# EAGLE design Backer Boards 01April15 (EAGLE 6.5.0)

## Sheet 1 of 7
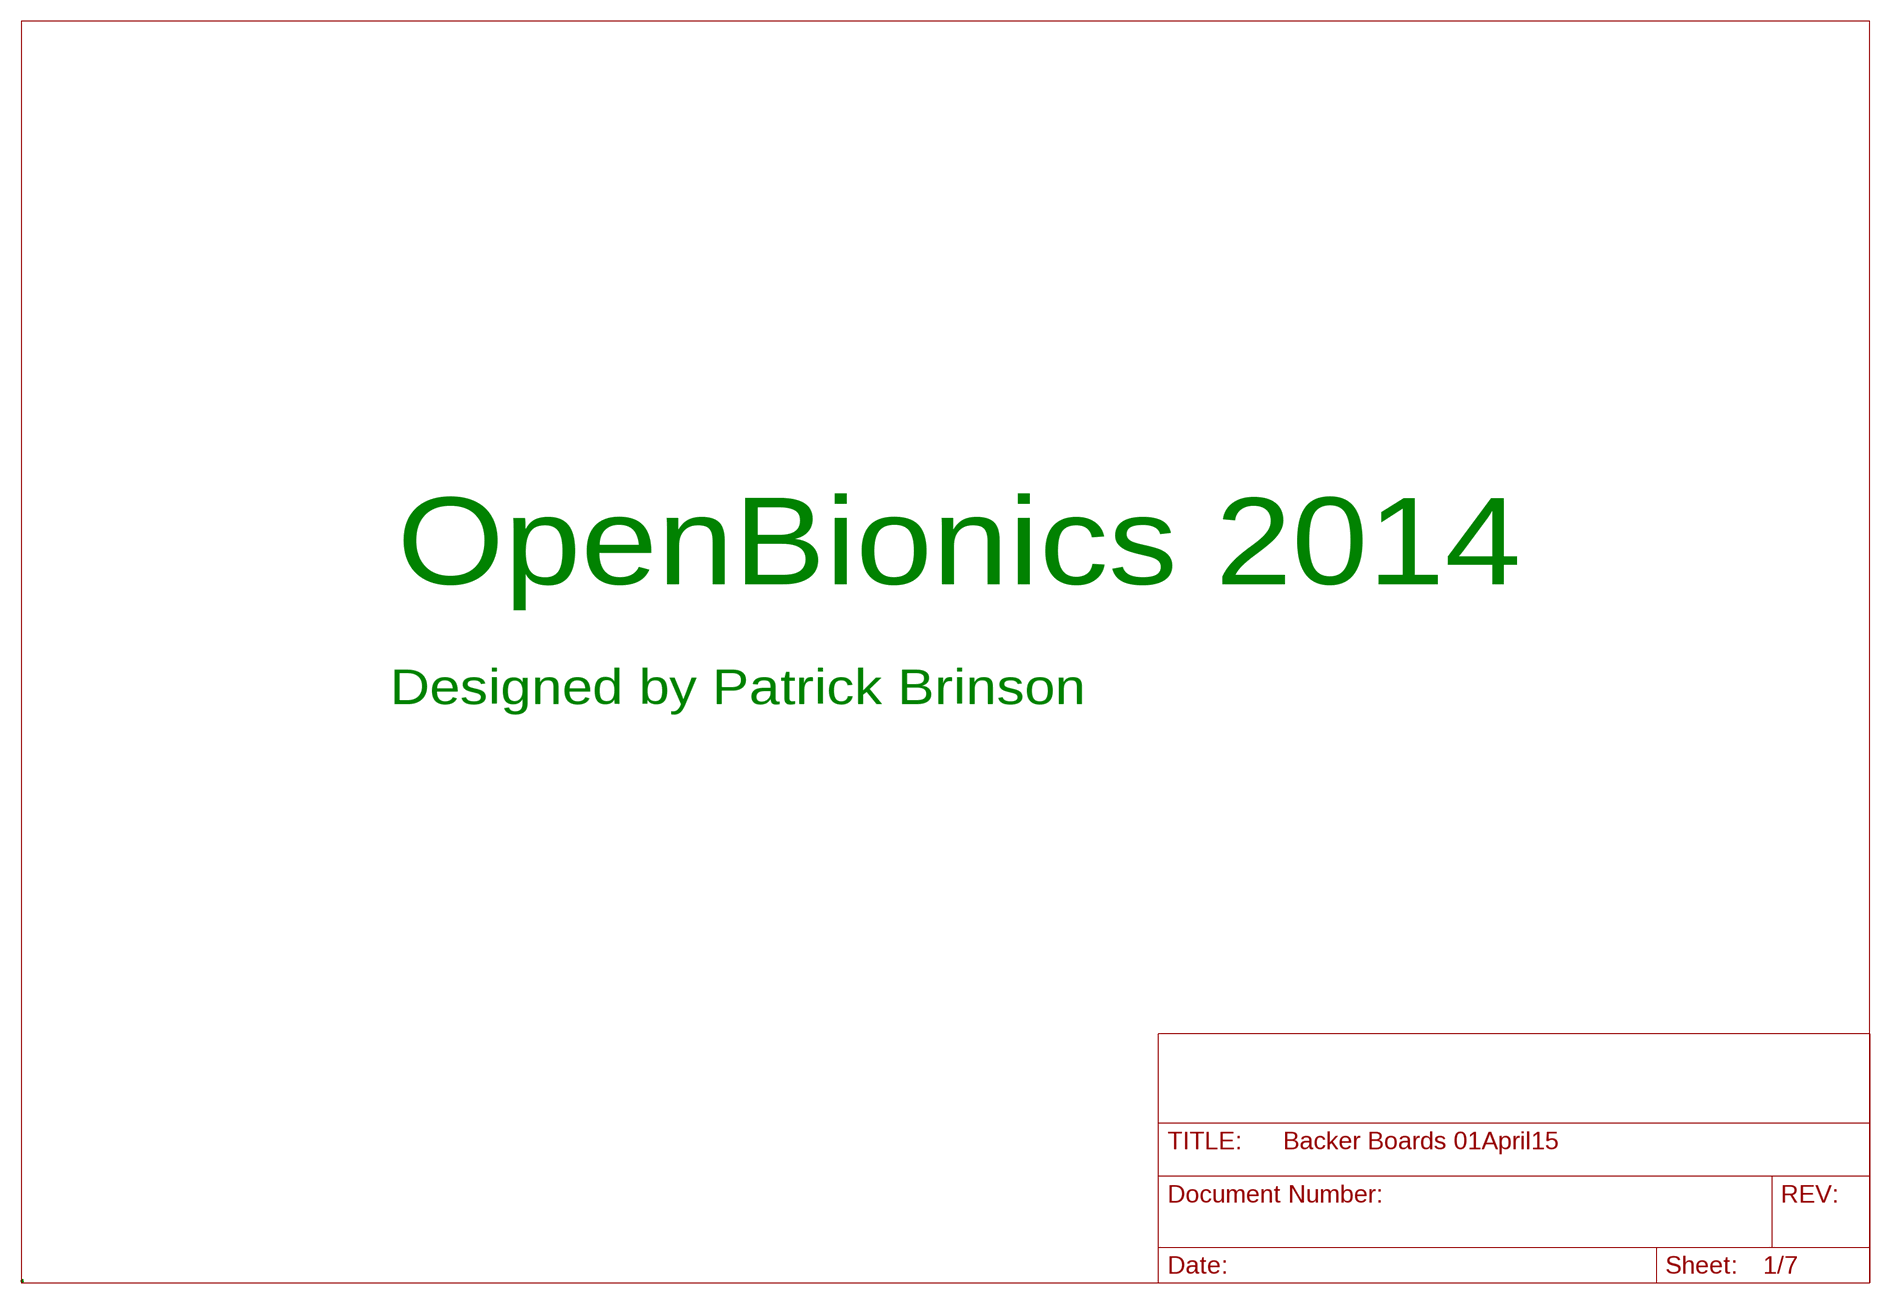
[diagram p0: schematic, sheet 1]

### Notes on the sheet
- OpenBionics 2014
- Designed by Patrick Brinson

## Sheet 2 of 7: POWER
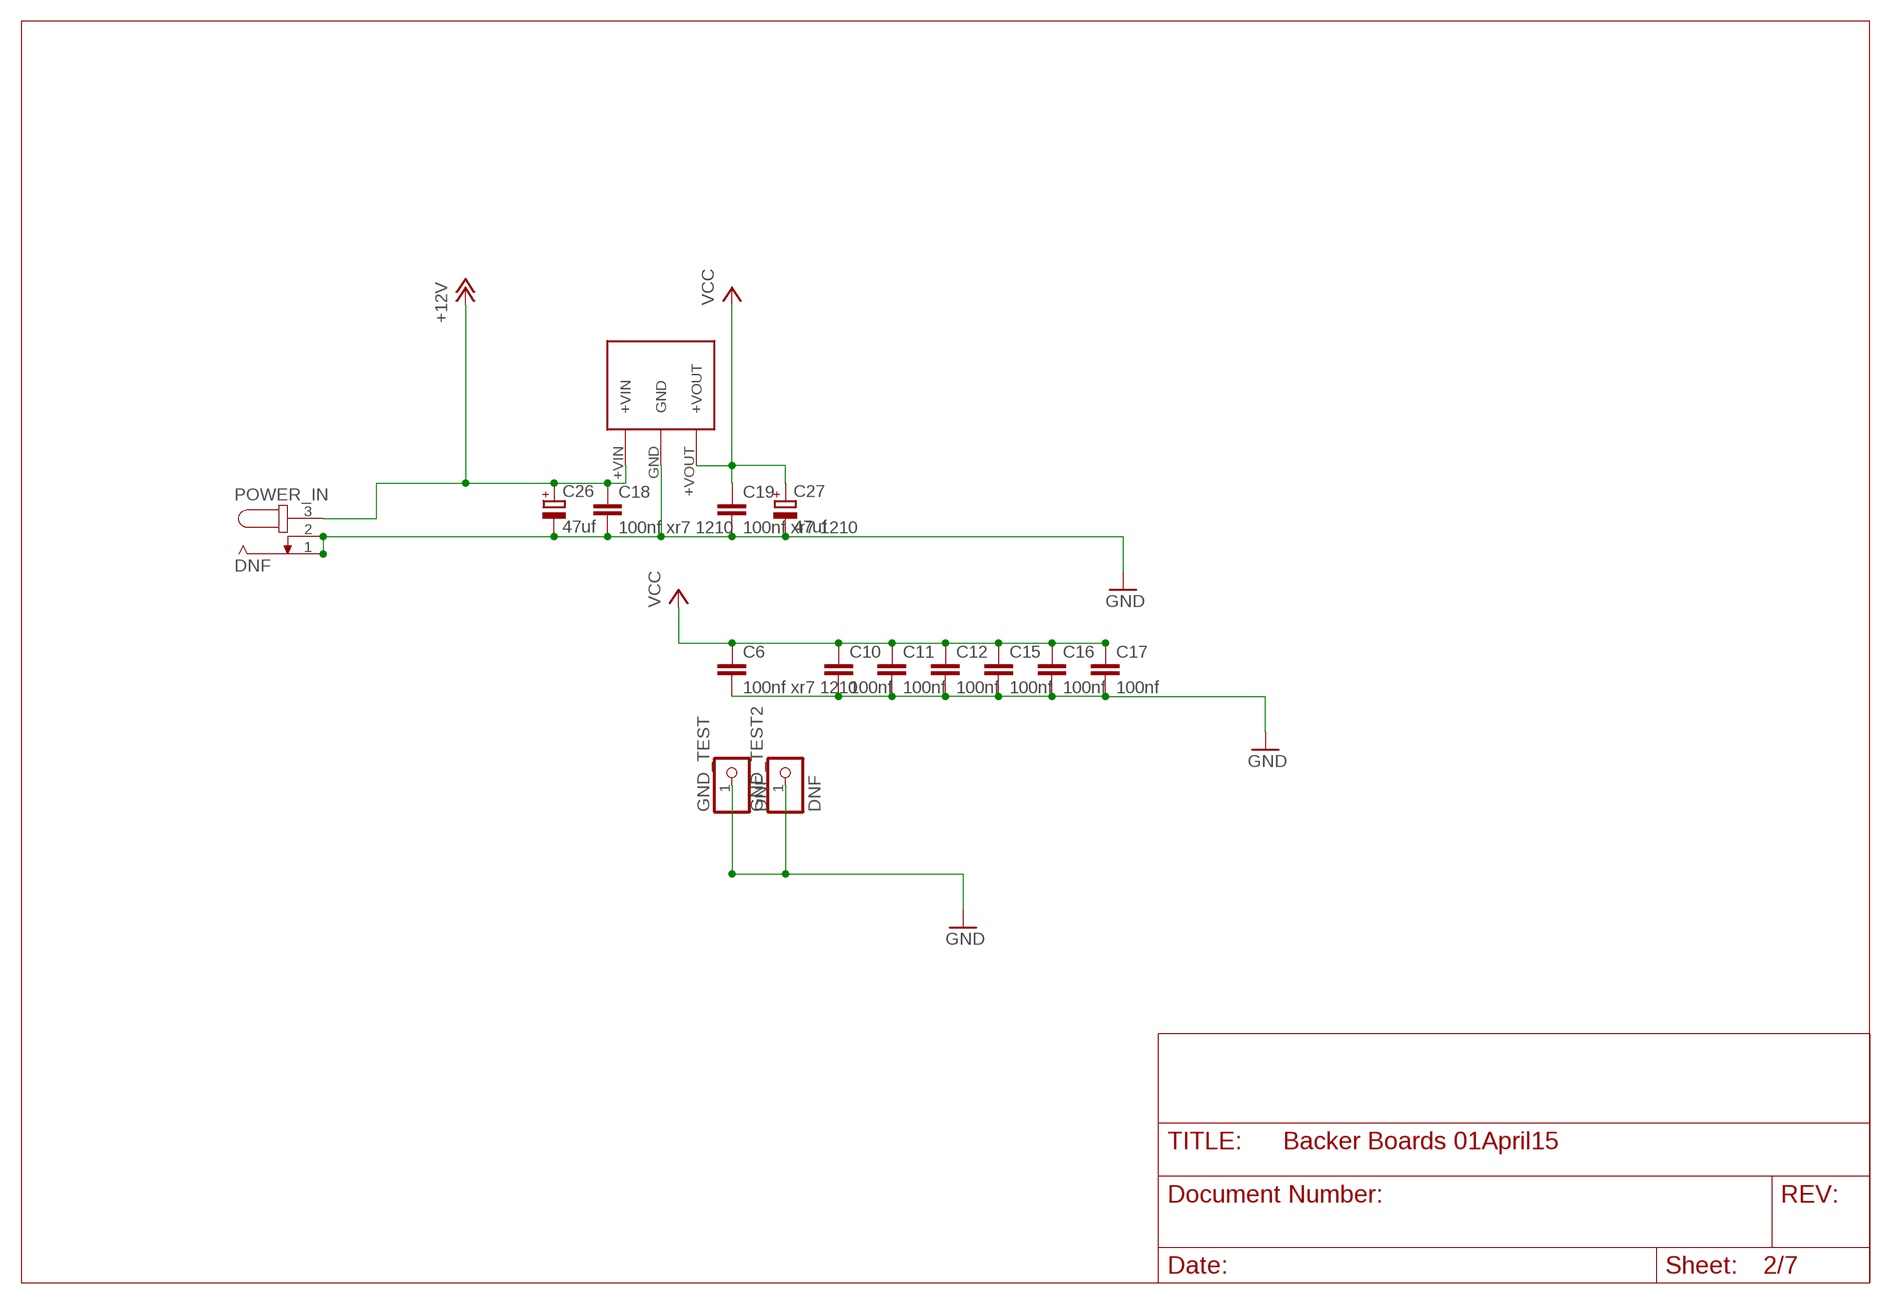
[diagram p1: schematic, sheet 2]

### Parts
5V_REG  DNF  5V_RECOM_0.5A_REGULATOR  [5V_RECOM_0.5A_REGULATOR]
C6  100nf xr7 1210  C-EUC1210  [C1210]
C10  100nf  C-EUC0603  [C0603]
C11  100nf  C-EUC0603  [C0603]
C12  100nf  C-EUC0603  [C0603]
C15  100nf  C-EUC0603  [C0603]
C16  100nf  C-EUC0603  [C0603]
C17  100nf  C-EUC0603  [C0603]
C18  100nf xr7 1210  C-EUC1210  [C1210]
C19  100nf xr7 1210  C-EUC1210  [C1210]
C26  47uf  CPOL-EUC  [PANASONIC_C]
C27  47uf  CPOL-EUC  [PANASONIC_C]
GND_TEST  DNF  HEADER-1X1ROUND  [1X01_ROUND]
GND_TEST2  DNF  HEADER-1X1ROUND  [1X01_ROUND]
POWER_IN  DNF  JACK-PLUG1  [SPC4078]

### Nets
+12V: 5V_REG.+VIN C18.1 C26.+ POWER_IN.3 ; also sheet 4,5,6
GND: 5V_REG.GND C6.2 C10.2 C11.2 C12.2 C15.2 C16.2 C17.2 C18.2 C19.2 C26.- C27.- GND_TEST2.1 GND_TEST.1 POWER_IN.1 POWER_IN.2 ; also sheet 3,4,5,6,7
VCC: 5V_REG.+VOUT C6.1 C10.1 C11.1 C12.1 C15.1 C16.1 C17.1 C19.1 C27.+ ; also sheet 3,4,5,6,7

## Sheet 3 of 7: ATMEGA 2560
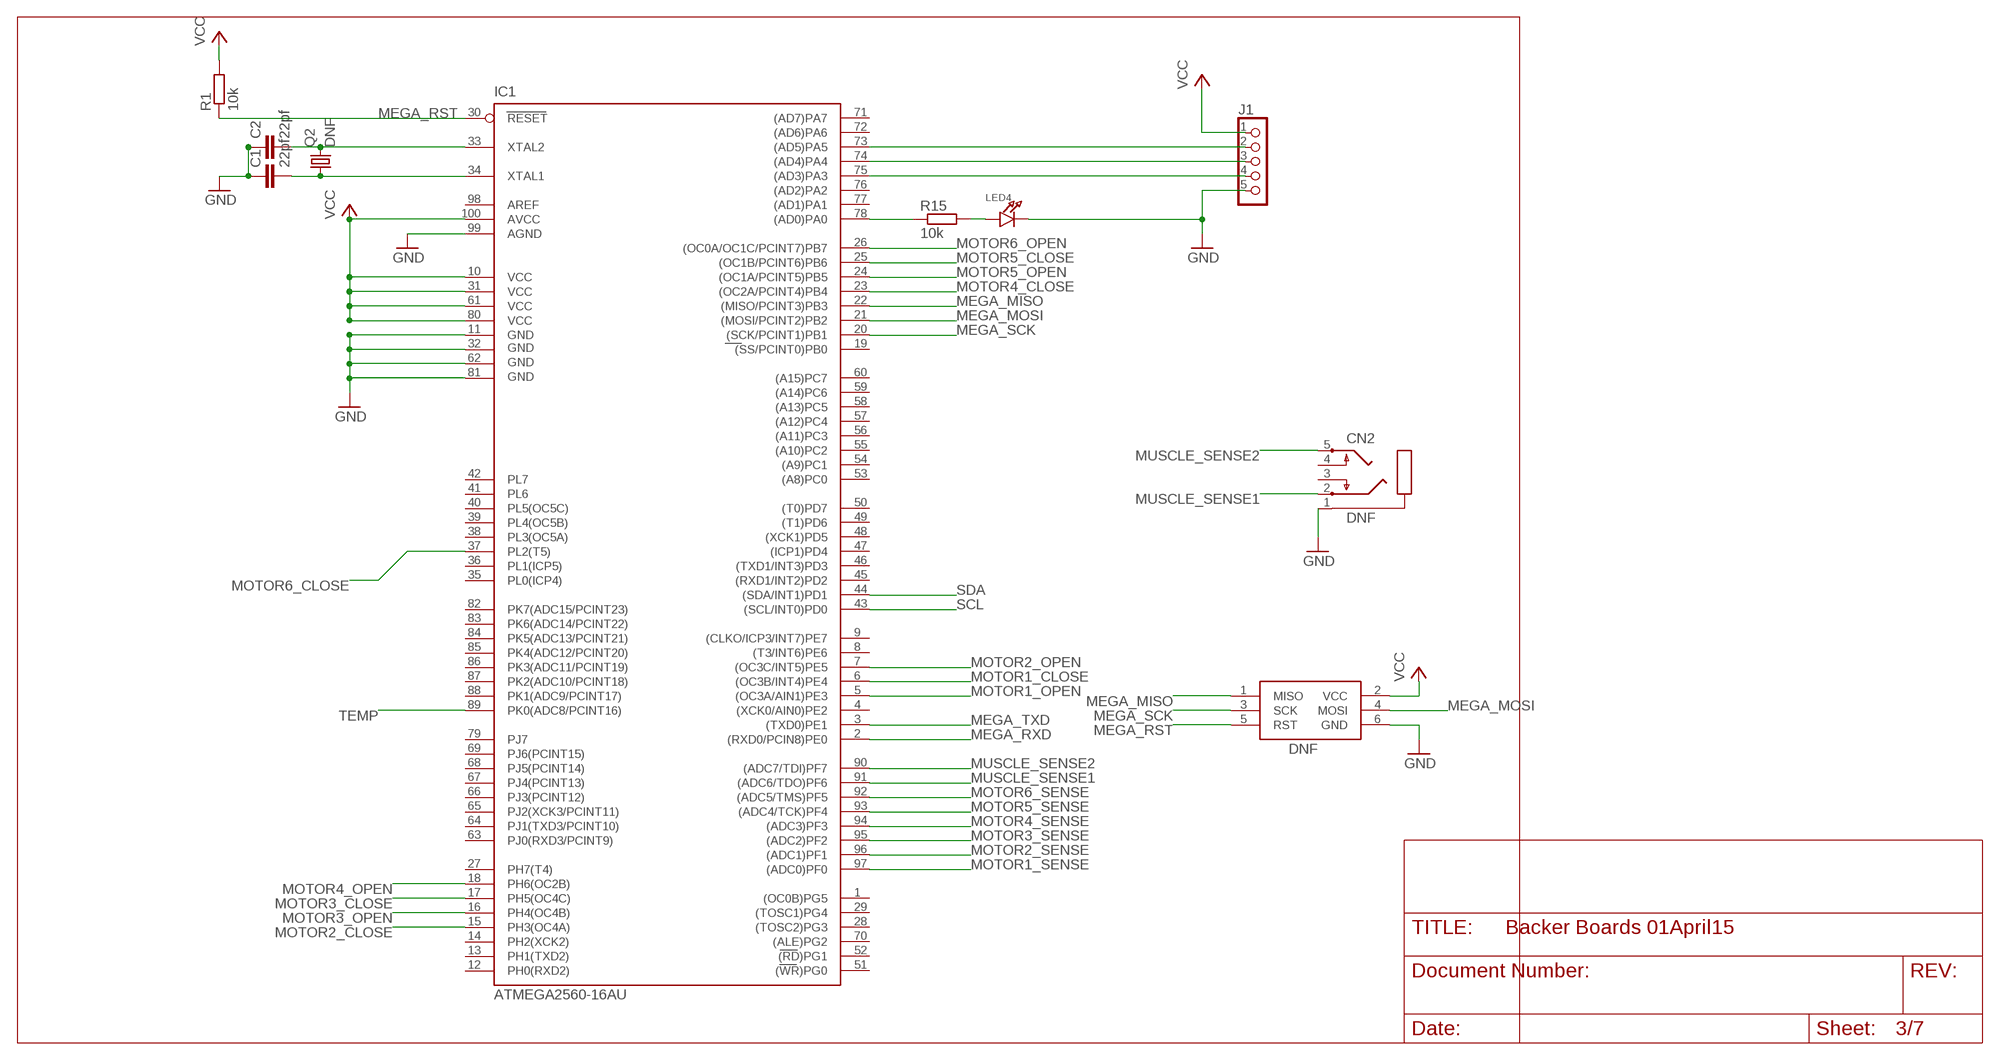
[diagram p2: schematic, sheet 3]

### Parts
C1  22pf  C-EUC0603  [C0603]
C2  22pf  C-EUC0603  [C0603]
CN2  DNF  AUDIO_STEREOJACK  [STX3100]
DNF  AVRISP-6  [AVRISP]
IC1  ATMEGA2560-16AU  [TQFP100]
J1  DNF  CON_HEADER_1X05-PTH  [M1X5]
LED4  LED0805  [CHIPLED_0805]
Q2  DNF  CRYSTALHC49S  [HC49/S]
R1  10k  R-EU_R0603  [R0603]
R15  10k  R-EU_R0603  [R0603]

### Nets
GND: C1.1 C2.1 CN2.1 DNF.6(GND) IC1.11(GND) IC1.32(GND1) IC1.62(GND2) IC1.81(GND3) IC1.99(AGND) J1.5 LED4.C ; also sheet 2,4,5,6,7
MEGA_MISO: DNF.1(MISO) IC1.22((MISO/PCINT3)PB3)
MEGA_MOSI: DNF.4(MOSI) IC1.21((MOSI/PCINT2)PB2)
MEGA_RST: DNF.5(RST) IC1.30(RESET) R1.1 ; also sheet 7
MEGA_RXD: IC1.2((RXD0/PCIN8)PE0) ; also sheet 7
MEGA_SCK: DNF.3(SCK) IC1.20((SCK/PCINT1)PB1)
MEGA_TXD: IC1.3((TXD0)PE1) ; also sheet 7
MOTOR1_CLOSE: IC1.6((OC3B/INT4)PE4) ; also sheet 4
MOTOR1_OPEN: IC1.5((OC3A/AIN1)PE3) ; also sheet 4
MOTOR1_SENSE: IC1.97((ADC0)PF0) ; also sheet 4
MOTOR2_CLOSE: IC1.15(PH3(OC4A)) ; also sheet 4
MOTOR2_OPEN: IC1.7((OC3C/INT5)PE5) ; also sheet 4
MOTOR2_SENSE: IC1.96((ADC1)PF1) ; also sheet 4
MOTOR3_CLOSE: IC1.17(PH5(OC4C)) ; also sheet 5
MOTOR3_OPEN: IC1.16(PH4(OC4B)) ; also sheet 5
MOTOR3_SENSE: IC1.95((ADC2)PF2) ; also sheet 5
MOTOR4_CLOSE: IC1.23((OC2A/PCINT4)PB4) ; also sheet 5
MOTOR4_OPEN: IC1.18(PH6(OC2B)) ; also sheet 5
MOTOR4_SENSE: IC1.94((ADC3)PF3) ; also sheet 5
MOTOR5_CLOSE: IC1.25((OC1B/PCINT6)PB6) ; also sheet 6
MOTOR5_OPEN: IC1.24((OC1A/PCINT5)PB5) ; also sheet 6
MOTOR5_SENSE: IC1.93((ADC4/TCK)PF4) ; also sheet 6
MOTOR6_CLOSE: IC1.37(PL2(T5))
MOTOR6_OPEN: IC1.26((OC0A/OC1C/PCINT7)PB7)
MOTOR6_SENSE: IC1.92((ADC5/TMS)PF5)
MUSCLE_SENSE1: CN2.2 IC1.91((ADC6/TDO)PF6)
MUSCLE_SENSE2: CN2.5 IC1.90((ADC7/TDI)PF7)
N$2: IC1.78((AD0)PA0) R15.1
N$11: LED4.A R15.2
N$29: IC1.75((AD3)PA3) J1.4
N$48: IC1.74((AD4)PA4) J1.3
N$50: IC1.73((AD5)PA5) J1.2
SCL: IC1.43((SCL/INT0)PD0)
SDA: IC1.44((SDA/INT1)PD1)
TEMP: IC1.89(PK0(ADC8/PCINT16))
VCC: DNF.2(VCC) IC1.10(VCC) IC1.31(VCC1) IC1.61(VCC2) IC1.80(VCC3) IC1.100(AVCC) J1.1 R1.2 ; also sheet 2,4,5,6,7
XTAL1: C1.2 IC1.34(XTAL1) Q2.1
XTAL2: C2.2 IC1.33(XTAL2) Q2.2
Unconnected: CN2.3 CN2.4 IC1.1((OC0B)PG5) IC1.4((XCK0/AIN0)PE2) IC1.8((T3/INT6)PE6) IC1.9((CLKO/ICP3/INT7)PE7) IC1.12(PH0(RXD2)) IC1.13(PH1(TXD2)) IC1.14(PH2(XCK2)) IC1.19((SS/PCINT0)PB0) IC1.27(PH7(T4)) IC1.28((TOSC2)PG3) IC1.29((TOSC1)PG4) IC1.35(PL0(ICP4)) IC1.36(PL1(ICP5)) IC1.38(PL3(OC5A)) IC1.39(PL4(OC5B)) IC1.40(PL5(OC5C)) IC1.41(PL6) IC1.42(PL7) IC1.45((RXD1/INT2)PD2) IC1.46((TXD1/INT3)PD3) IC1.47((ICP1)PD4) IC1.48((XCK1)PD5) IC1.49((T1)PD6) IC1.50((T0)PD7) IC1.51((WR)PG0) IC1.52((RD)PG1) IC1.53((A8)PC0) IC1.54((A9)PC1) IC1.55((A10)PC2) IC1.56((A11)PC3) IC1.57((A12)PC4) IC1.58((A13)PC5) IC1.59((A14)PC6) IC1.60((A15)PC7) IC1.63(PJ0(RXD3/PCINT9)) IC1.64(PJ1(TXD3/PCINT10)) IC1.65(PJ2(XCK3/PCINT11)) IC1.66(PJ3(PCINT12)) IC1.67(PJ4(PCINT13)) IC1.68(PJ5(PCINT14)) IC1.69(PJ6(PCINT15)) IC1.70((ALE)PG2) IC1.71((AD7)PA7) IC1.72((AD6)PA6) IC1.76((AD2)PA2) IC1.77((AD1)PA1) IC1.79(PJ7) IC1.82(PK7(ADC15/PCINT23)) IC1.83(PK6(ADC14/PCINT22)) IC1.84(PK5(ADC13/PCINT21)) IC1.85(PK4(ADC12/PCINT20)) IC1.86(PK3(ADC11/PCINT19)) IC1.87(PK2(ADC10/PCINT18)) IC1.88(PK1(ADC9/PCINT17)) IC1.98(AREF)

## Sheet 4 of 7: MOTOR 1&2
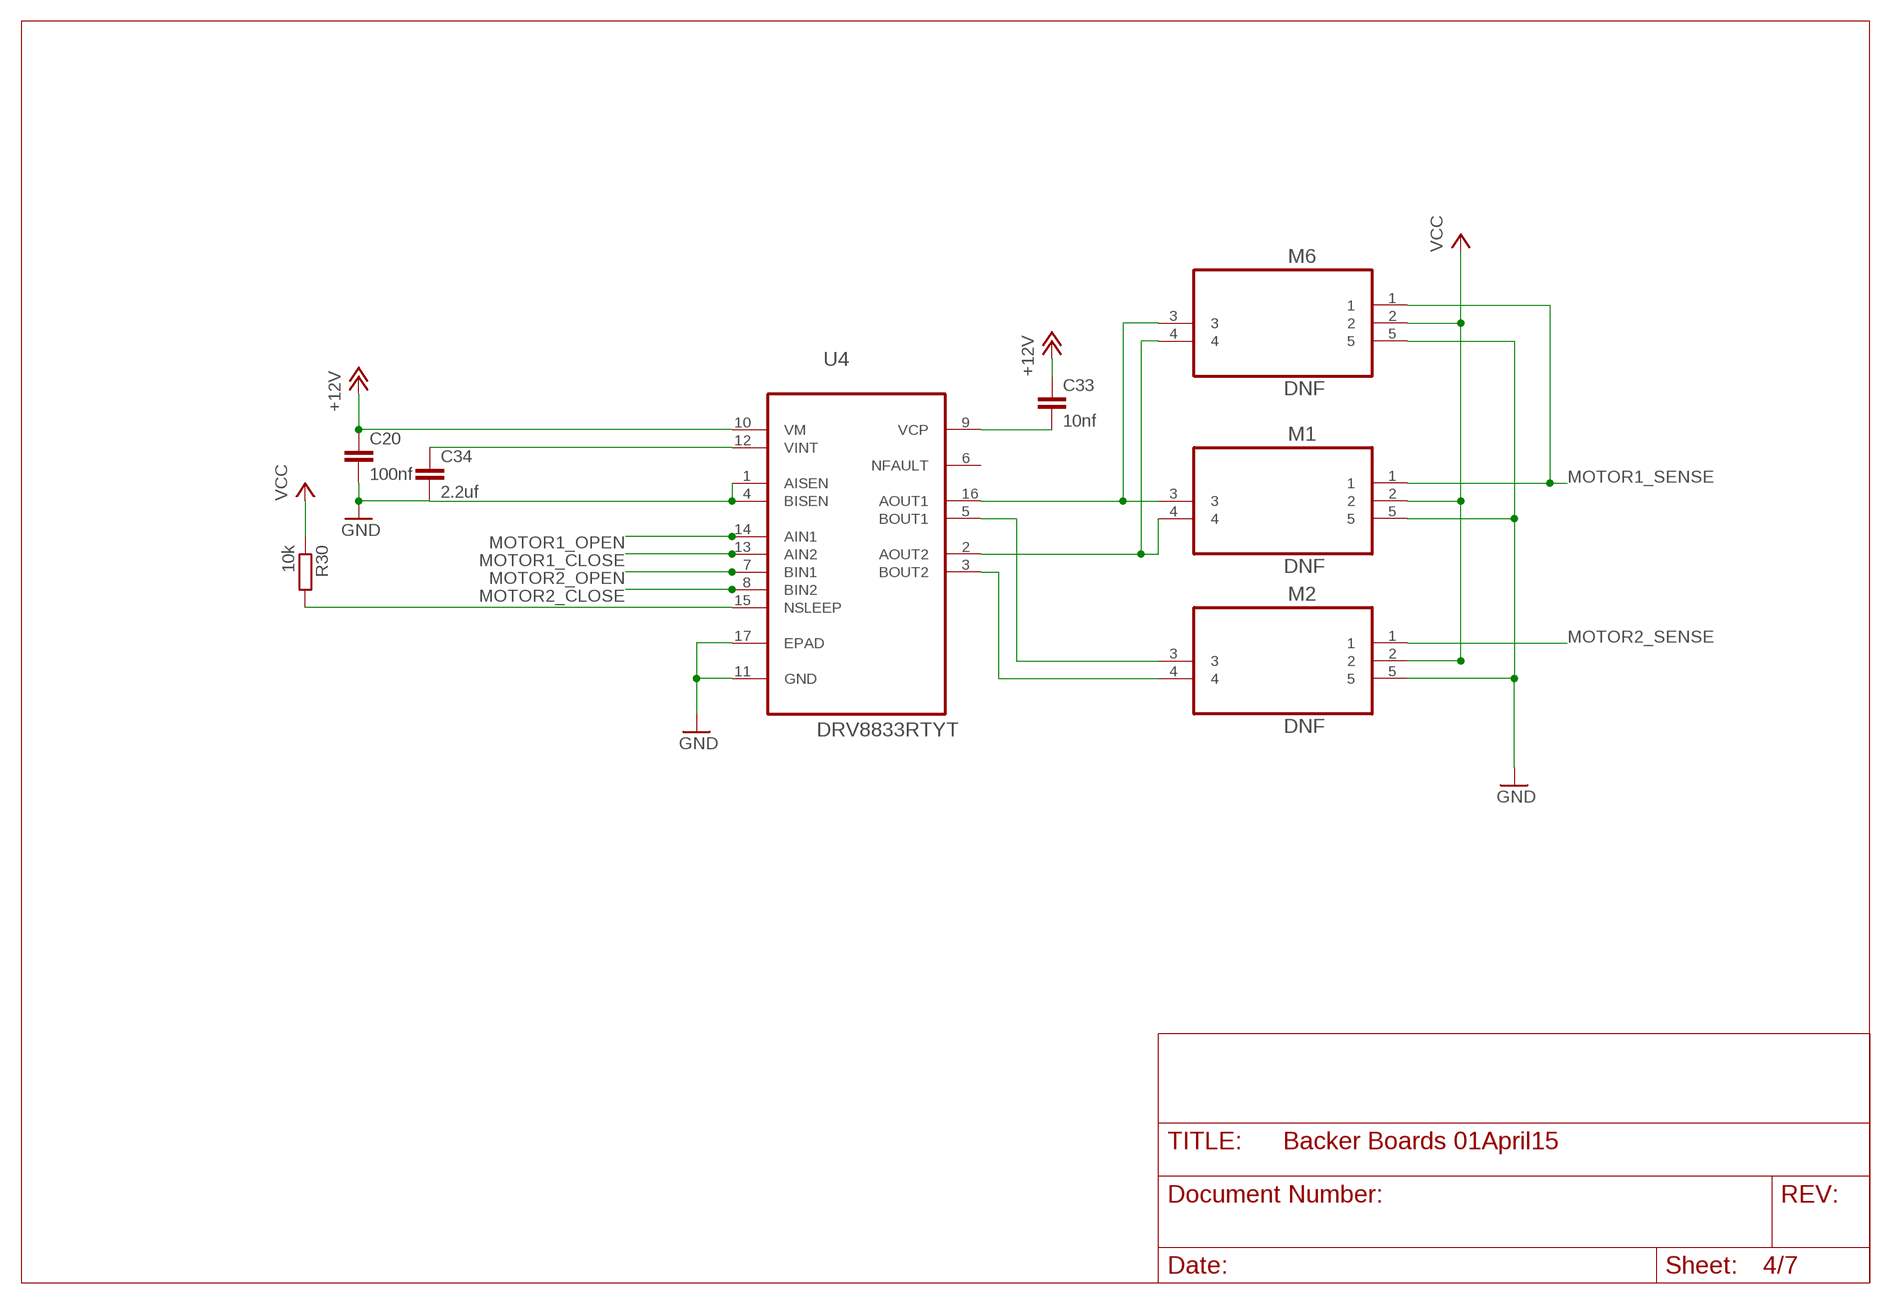
[diagram p3: schematic, sheet 4]

### Parts
C20  100nf  C-EUC0603  [C0603]
C33  10nf  C-EUC0603  [C0603]
C34  2.2uf  C-EUC0603  [C0603]
M1  DNF  SFW5R-1STE1LF  [FCI_SFW5R-1STE1LF]
M2  DNF  SFW5R-1STE1LF  [FCI_SFW5R-1STE1LF]
M6  DNF  SFW5R-1STE1LF  [FCI_SFW5R-1STE1LF]
R30  10k  R-EU_R0603  [R0603]
U4  DRV8833RTYT  [QFN65P400X400X80-17N]

### Nets
+12V: C20.1 C33.1 U4.10(VM) ; also sheet 2,5,6
GND: C20.2 C34.2 M1.5 M2.5 M6.5 U4.1(AISEN) U4.4(BISEN) U4.11(GND) U4.17(EPAD) ; also sheet 2,3,5,6,7
MOTOR1_CLOSE: U4.13(AIN2) ; also sheet 3
MOTOR1_OPEN: U4.14(AIN1) ; also sheet 3
MOTOR1_SENSE: M1.1 M6.1 ; also sheet 3
MOTOR2_CLOSE: U4.8(BIN2) ; also sheet 3
MOTOR2_OPEN: U4.7(BIN1) ; also sheet 3
MOTOR2_SENSE: M2.1 ; also sheet 3
N$8: C33.2 U4.9(VCP)
N$33: M1.3 M6.3 U4.16(AOUT1)
N$34: M1.4 M6.4 U4.2(AOUT2)
N$35: M2.3 U4.5(BOUT1)
N$36: M2.4 U4.3(BOUT2)
N$38: R30.2 U4.15(NSLEEP)
N$42: C34.1 U4.12(VINT)
VCC: M1.2 M2.2 M6.2 R30.1 ; also sheet 2,3,5,6,7
Unconnected: U4.6(NFAULT)

## Sheet 5 of 7: MOTOR 3&4
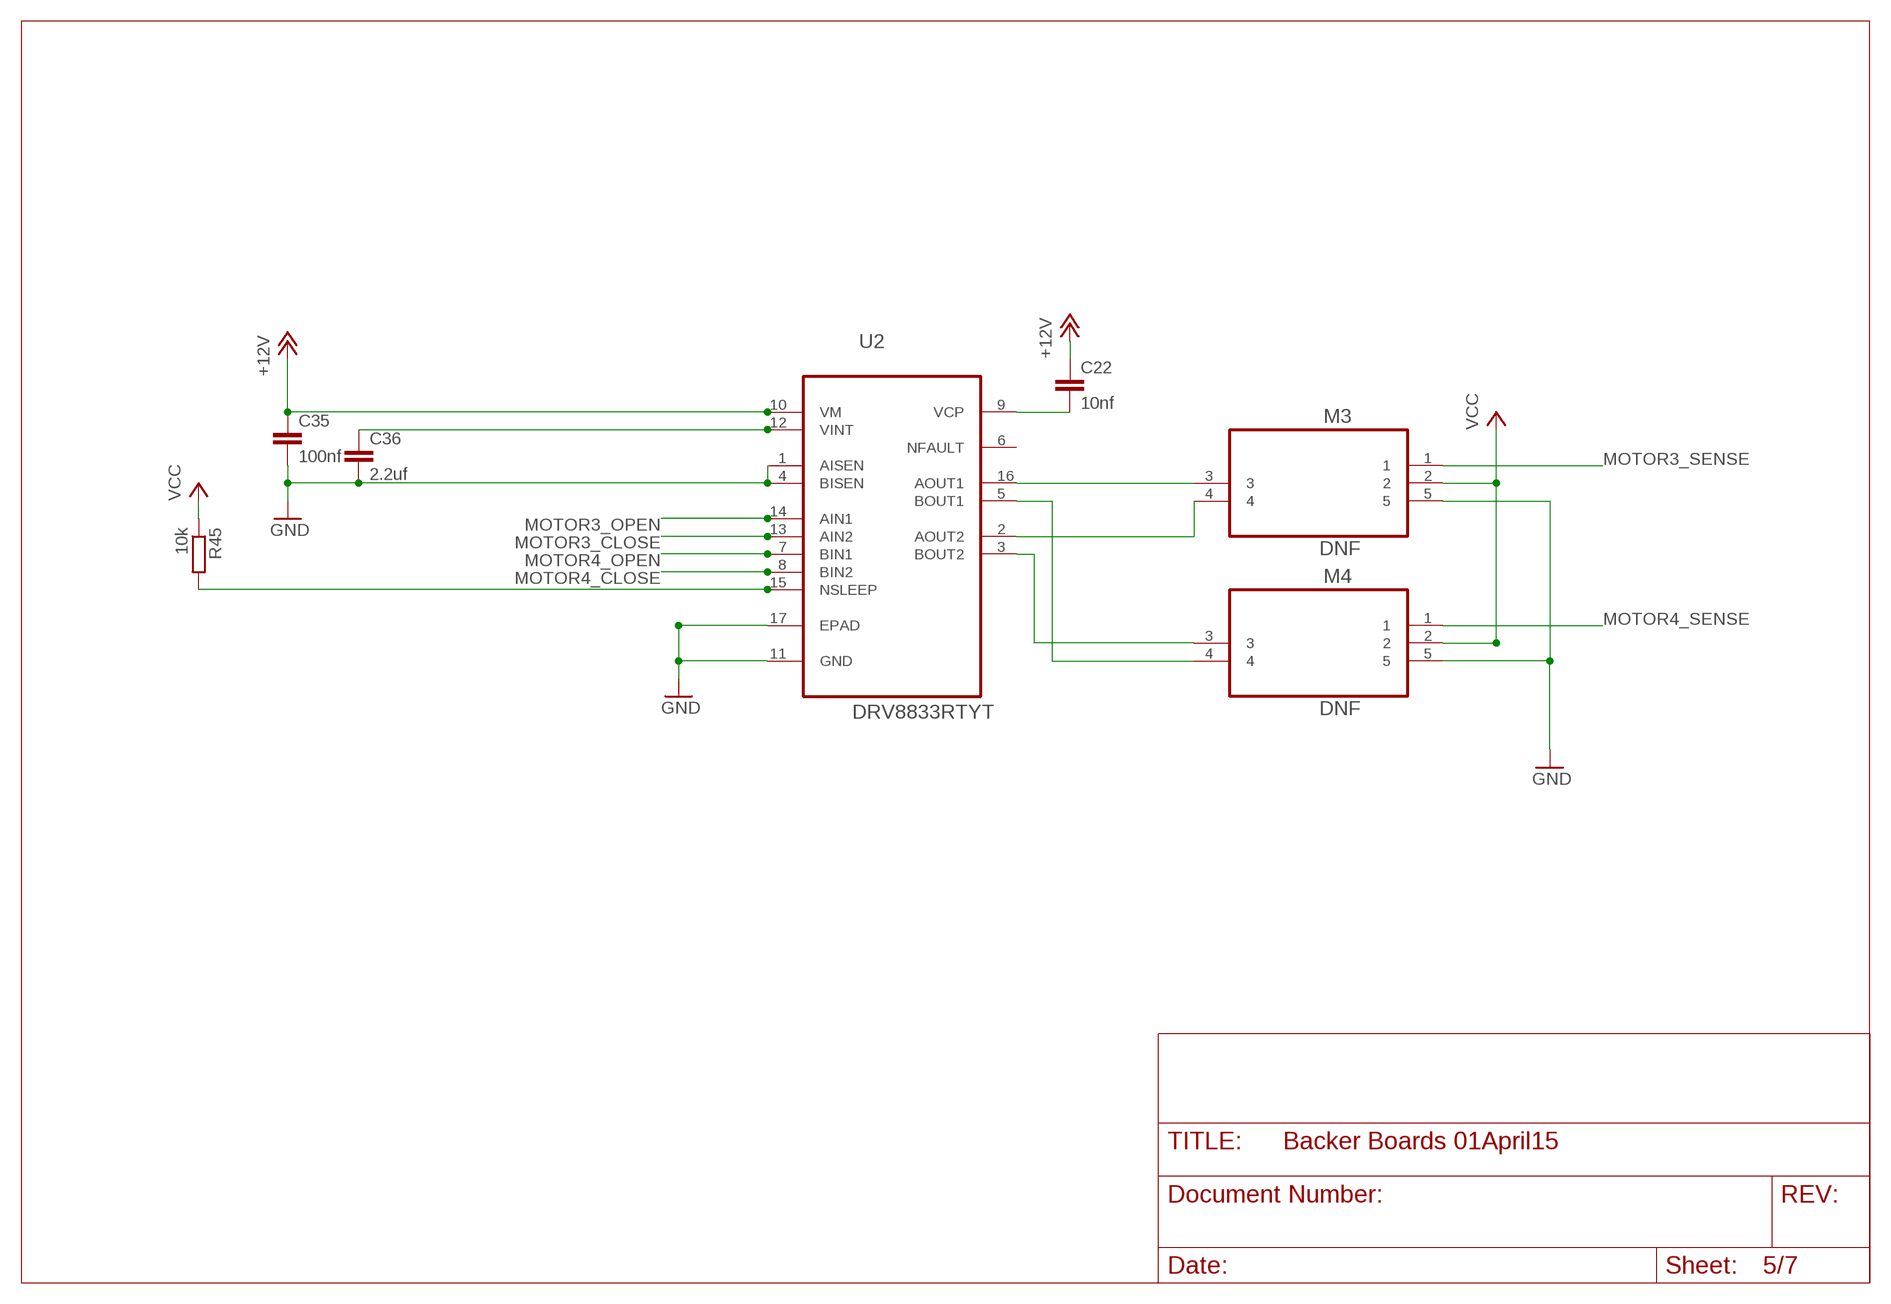
[diagram p4: schematic, sheet 5]

### Parts
C22  10nf  C-EUC0603  [C0603]
C35  100nf  C-EUC0603  [C0603]
C36  2.2uf  C-EUC0603  [C0603]
M3  DNF  SFW5R-1STE1LF  [FCI_SFW5R-1STE1LF]
M4  DNF  SFW5R-1STE1LF  [FCI_SFW5R-1STE1LF]
R45  10k  R-EU_R0603  [R0603]
U2  DRV8833RTYT  [QFN65P400X400X80-17N]

### Nets
+12V: C22.1 C35.1 U2.10(VM) ; also sheet 2,4,6
GND: C35.2 C36.2 M3.5 M4.5 U2.1(AISEN) U2.4(BISEN) U2.11(GND) U2.17(EPAD) ; also sheet 2,3,4,6,7
MOTOR3_CLOSE: U2.13(AIN2) ; also sheet 3
MOTOR3_OPEN: U2.14(AIN1) ; also sheet 3
MOTOR3_SENSE: M3.1 ; also sheet 3
MOTOR4_CLOSE: U2.8(BIN2) ; also sheet 3
MOTOR4_OPEN: U2.7(BIN1) ; also sheet 3
MOTOR4_SENSE: M4.1 ; also sheet 3
N$23: M3.3 U2.16(AOUT1)
N$30: M3.4 U2.2(AOUT2)
N$31: M4.4 U2.5(BOUT1)
N$32: M4.3 U2.3(BOUT2)
N$43: C22.2 U2.9(VCP)
N$44: C36.1 U2.12(VINT)
N$45: R45.2 U2.15(NSLEEP)
VCC: M3.2 M4.2 R45.1 ; also sheet 2,3,4,6,7
Unconnected: U2.6(NFAULT)

## Sheet 6 of 7: MOTOR 5 & SERVO
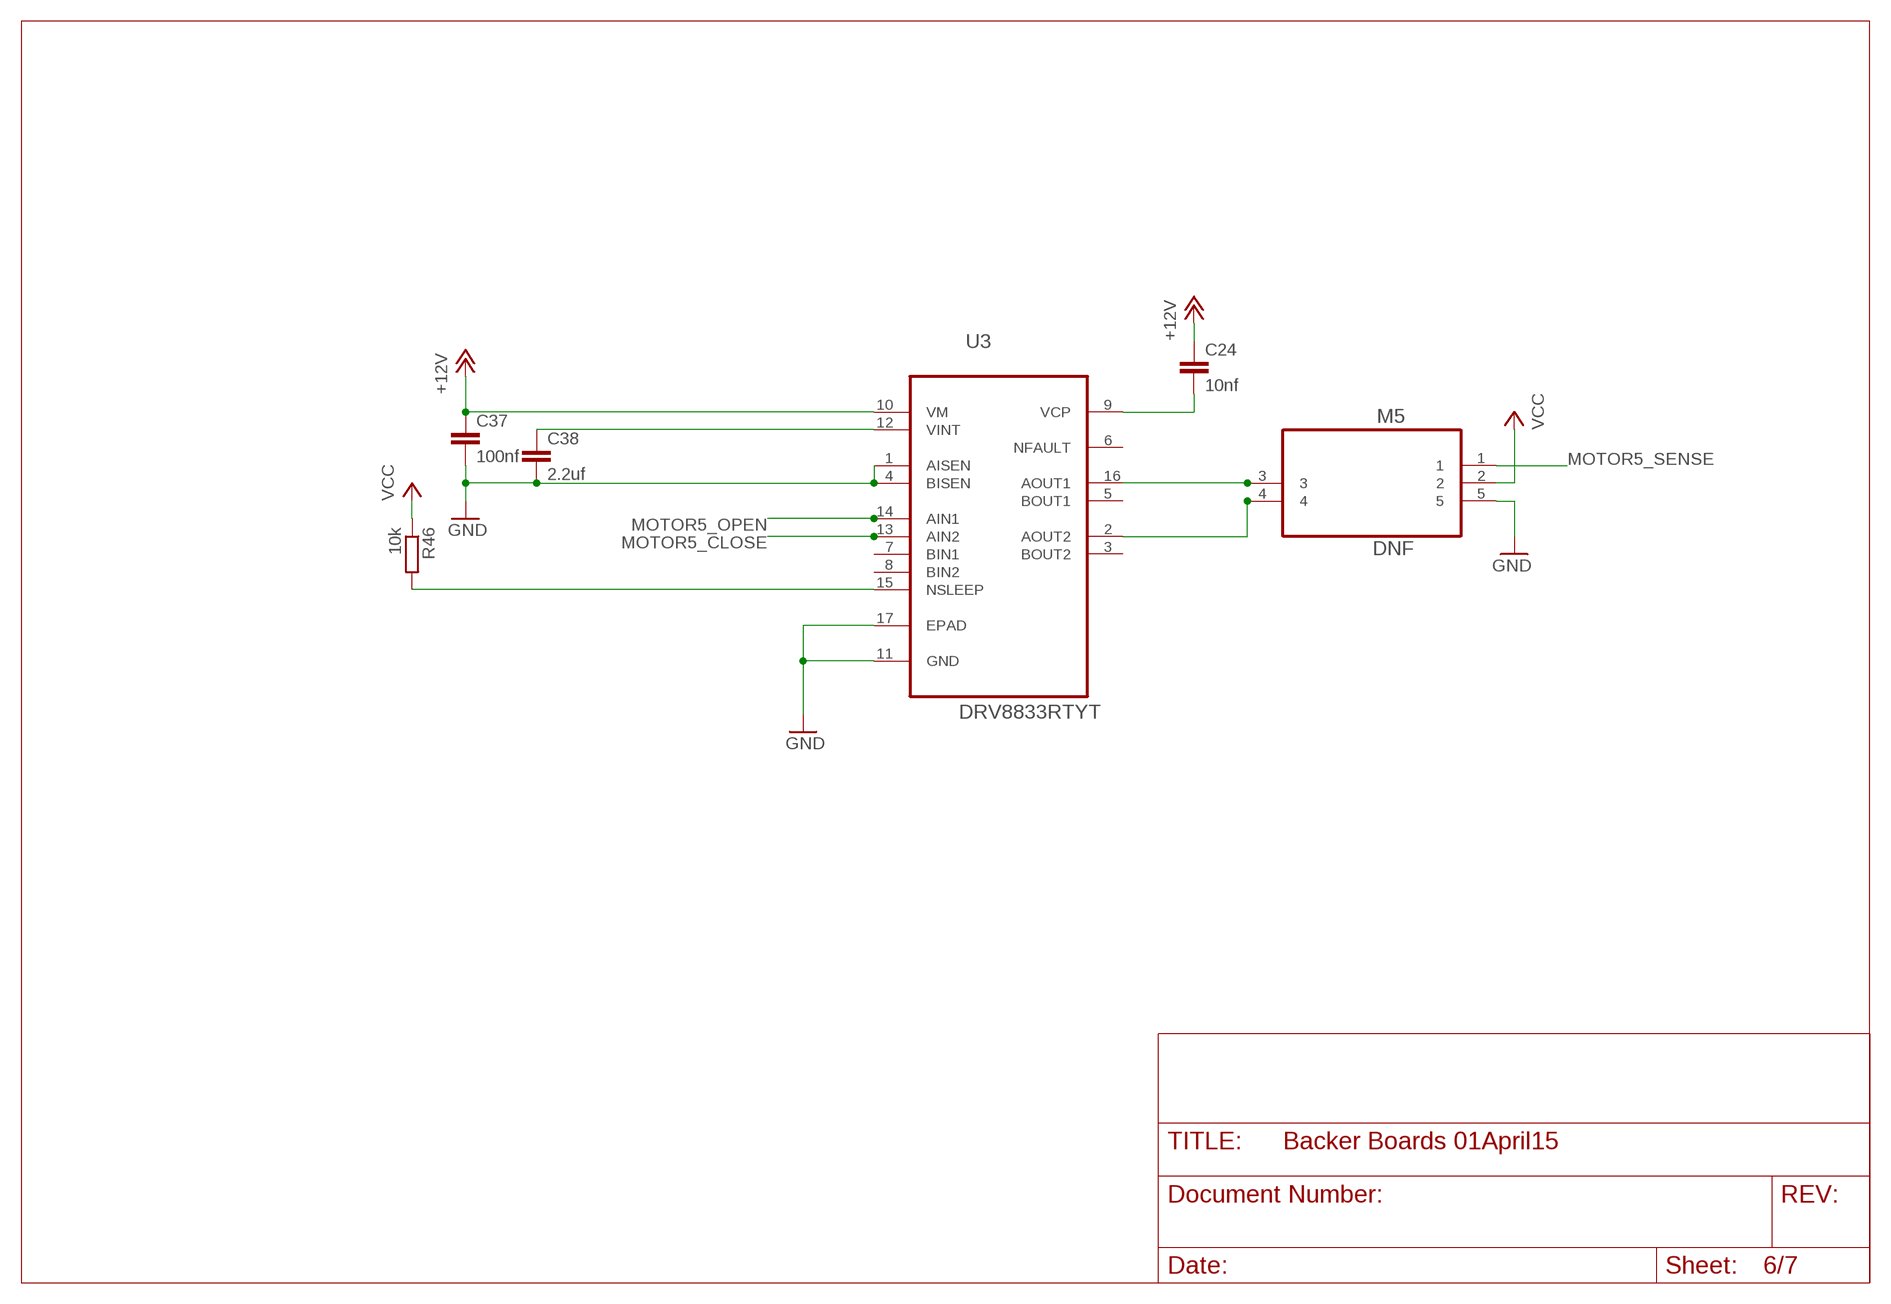
[diagram p5: schematic, sheet 6]

### Parts
C24  10nf  C-EUC0603  [C0603]
C37  100nf  C-EUC0603  [C0603]
C38  2.2uf  C-EUC0603  [C0603]
M5  DNF  SFW5R-1STE1LF  [FCI_SFW5R-1STE1LF]
R46  10k  R-EU_R0603  [R0603]
U3  DRV8833RTYT  [QFN65P400X400X80-17N]

### Nets
+12V: C24.1 C37.1 U3.10(VM) ; also sheet 2,4,5
GND: C37.2 C38.2 M5.5 U3.1(AISEN) U3.4(BISEN) U3.11(GND) U3.17(EPAD) ; also sheet 2,3,4,5,7
MOTOR5_CLOSE: U3.13(AIN2) ; also sheet 3
MOTOR5_OPEN: U3.14(AIN1) ; also sheet 3
MOTOR5_SENSE: M5.1 ; also sheet 3
N$27: M5.4 U3.2(AOUT2)
N$28: M5.3 U3.16(AOUT1)
N$47: C38.1 U3.12(VINT)
N$49: C24.2 U3.9(VCP)
N$51: R46.2 U3.15(NSLEEP)
VCC: M5.2 R46.1 ; also sheet 2,3,4,5,7
Unconnected: U3.3(BOUT2) U3.5(BOUT1) U3.6(NFAULT) U3.7(BIN1) U3.8(BIN2)

## Sheet 7 of 7: USB
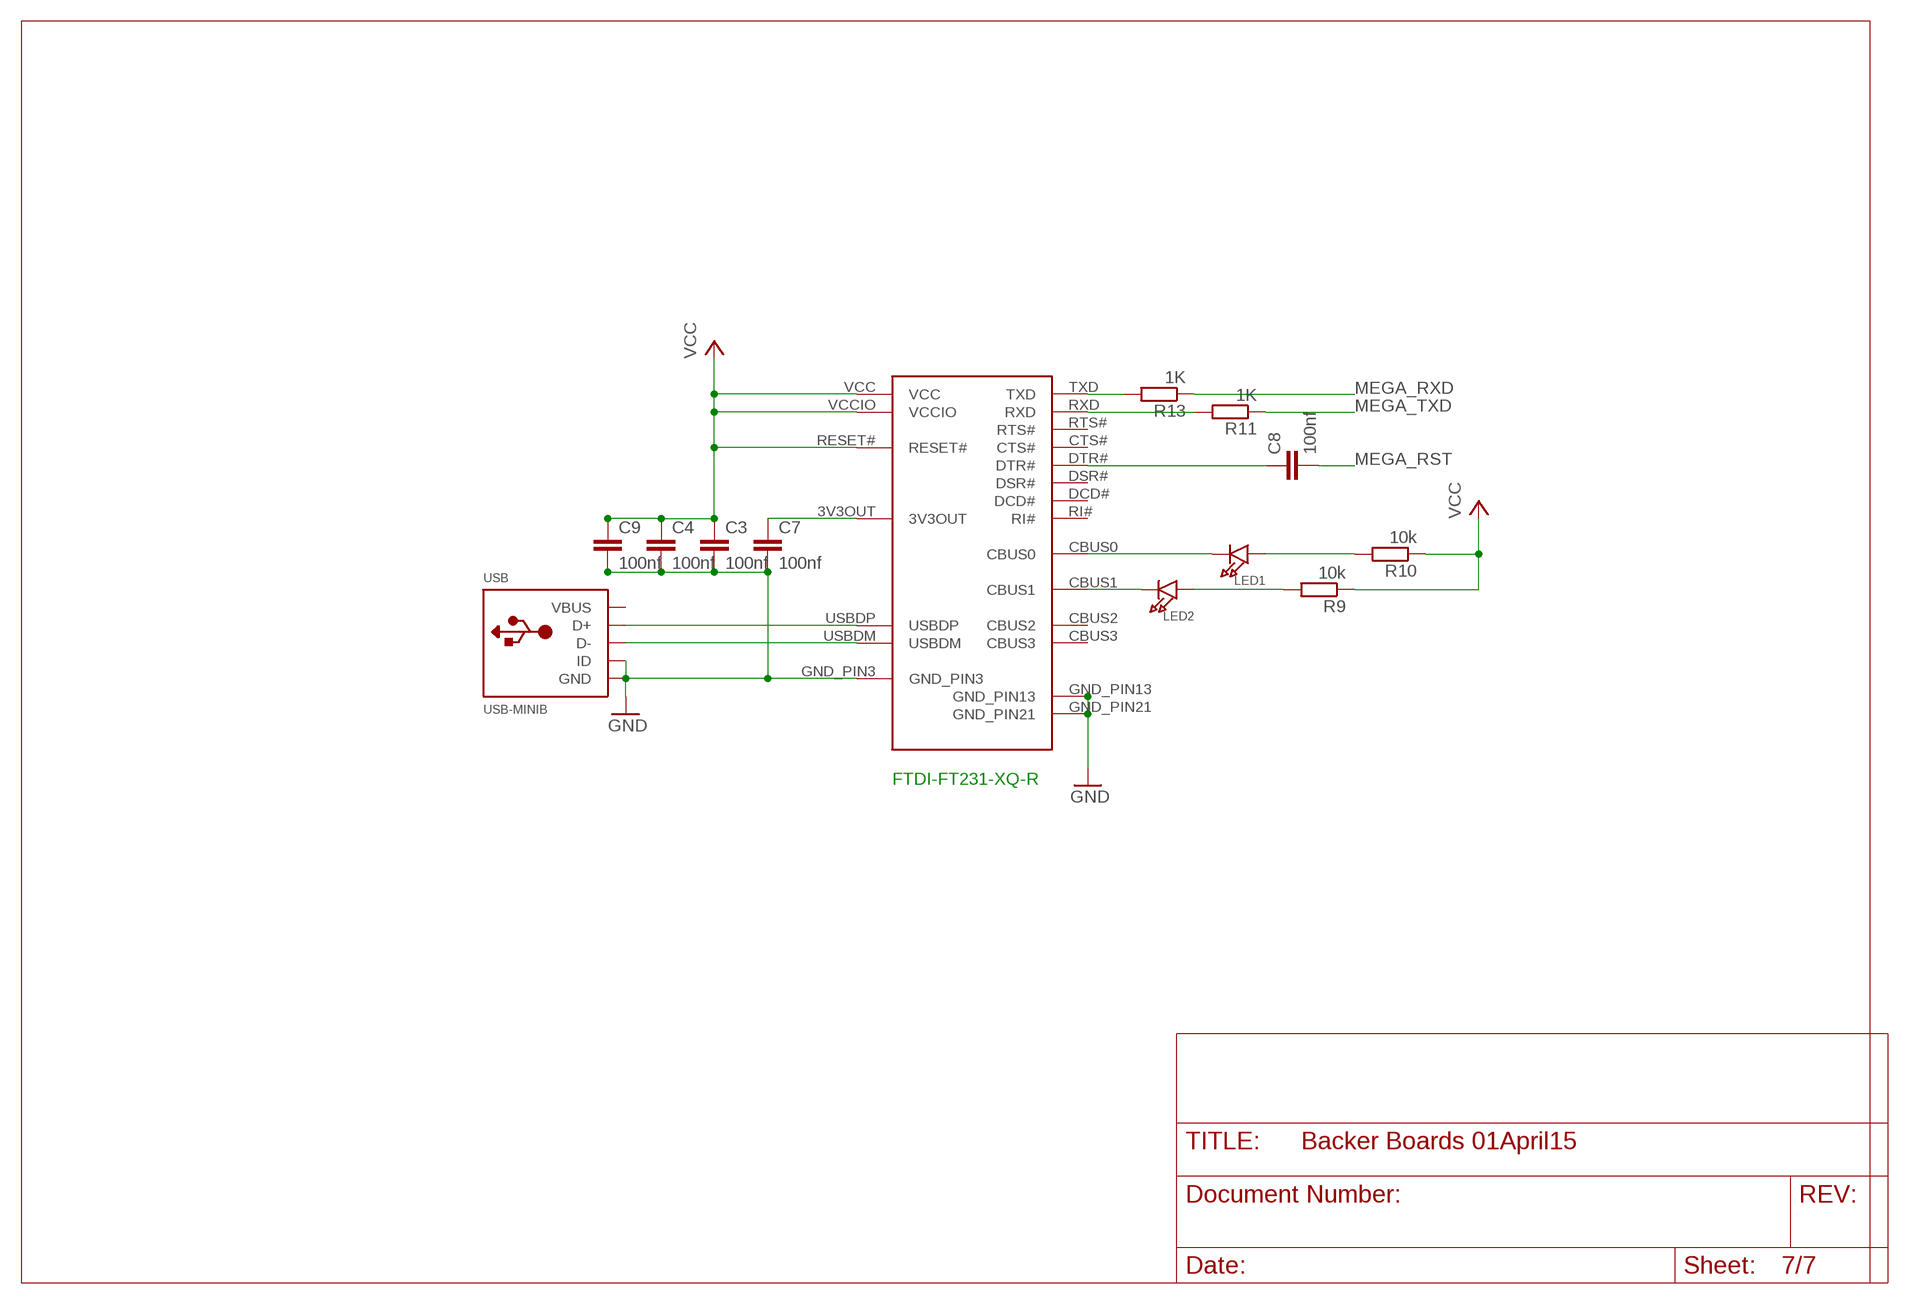
[diagram p6: schematic, sheet 7]

### Parts
C3  100nf  C-EUC0603  [C0603]
C4  100nf  C-EUC0603  [C0603]
C7  100nf  C-EUC0603  [C0603]
C8  100nf  C-EUC0603  [C0603]
C9  100nf  C-EUC0603  [C0603]
FTDI-FT231-XQ-R  FT231XQ-R  [FTDI_FT231XQ-R_PACKAGE]
LED1  LED0805  [CHIPLED_0805]
LED2  LED0805  [CHIPLED_0805]
R9  10k  R-EU_R0603  [R0603]
R10  10k  R-EU_R0603  [R0603]
R11  1K  R-EU_R0603  [R0603]
R13  1K  R-EU_R0603  [R0603]
USB  USB-MINIB  USBMINIB  [USB-MINIB]

### Nets
GND: C3.2 C4.2 C7.2 C9.2 FTDI-FT231-XQ-R.GND_PIN3 FTDI-FT231-XQ-R.GND_PIN13 FTDI-FT231-XQ-R.GND_PIN21 USB.GND USB.ID ; also sheet 2,3,4,5,6
MEGA_RST: C8.2 ; also sheet 3
MEGA_RXD: R13.1 ; also sheet 3
MEGA_TXD: R11.1 ; also sheet 3
N$13: FTDI-FT231-XQ-R.USBDP USB.D+
N$14: FTDI-FT231-XQ-R.USBDM USB.D-
N$15: C7.1 FTDI-FT231-XQ-R.3V3OUT
N$16: C8.1 FTDI-FT231-XQ-R.DTR#
N$18: FTDI-FT231-XQ-R.TXD R13.2
N$19: FTDI-FT231-XQ-R.RXD R11.2
N$20: FTDI-FT231-XQ-R.CBUS0 LED1.C
N$21: FTDI-FT231-XQ-R.CBUS1 LED2.C
N$22: LED2.A R9.2
N$24: LED1.A R10.2
VCC: C3.1 C4.1 C9.1 FTDI-FT231-XQ-R.RESET# FTDI-FT231-XQ-R.VCC FTDI-FT231-XQ-R.VCCIO R9.1 R10.1 ; also sheet 2,3,4,5,6
Unconnected: FTDI-FT231-XQ-R.CBUS2 FTDI-FT231-XQ-R.CBUS3 FTDI-FT231-XQ-R.CTS# FTDI-FT231-XQ-R.DCD# FTDI-FT231-XQ-R.DSR# FTDI-FT231-XQ-R.RI# FTDI-FT231-XQ-R.RTS#

### Notes on the sheet
- FTDI-FT231-XQ-R

## Power pins joined to a net without a drawn wire
VBUS: USB.VBUS

## Library data of the parts
5V_REG = Recom 5V 0.5A OpenHand Voltage Regulator:5V_RECOM_0.5A_REGULATOR
C1-C4 C6-C12 C15-C20 C22 C24 C33-C38 = resistor:C-EU: CAPACITOR, European symbol
C26 C27 = resistor:CPOL-EU: POLARIZED CAPACITOR, European symbol
CN2 = 2mm connector:AUDIO_STEREOJACK: MIC/HEADPHONE JACK Stereo jack with two switches. Kycon STX3100, CUI SJ1-3555NG and/or 4UCon 05544 Digikey: CP1-3555NG-ND Shamelessly taken from the Adafruit Eagle library (public domain) ... thanks! These are normally connected as follows, from right-to-left on the schematic symbol above: Tip: Left Audio Inner Ring: Right Audio Shell: Common/GND
DNF = adafruit:AVRISP: AVR ISP HEADER Standard 6 pin header for AVR programming
FTDI-FT231-XQ-R = ftdi_ft231xq-r:FT231XQ-R: This is the 20-LD QFN package of the FTDI FT231XQ-R chip.
GND_TEST GND_TEST2 = microbuilder:HEADER-1X1: PIN HEADER
IC1 = atmel-2005:ATMEGA*: MICROCONTROLLER 64/128/256 Kbytes FLASH 4 Kbytes EEPROM 8 Kbytes SRAM 86 General Purpose I/O pins 12-channels16-bit PWM 4 x Serial USARTs 16-channels 10-bit A/D
J1 = dp_devices:CON_HEADER_1X05
LED1 LED2 LED4 = microbuilder:LED: LED 0603 - 0603 Surface Mount Package 2mA: Green LED - Low Power (3.9mcd, 2ma, 1.7Vf) - Digikey: 475-2709-2-ND Orange LED - Low Power (9.8mcd, 2ma, 1.8Vf) - Digikey: 475-1194-2-ND Red LED - Low Power (5mcd, 2ma, 1.8Vf) - Digikey: 475-1195-2-ND Yellow LED - Low Power (7mcd, 2ma, 1.8Vf) - Digikey: 475-1196-2-ND 5mA: Blue LED - Low Power (17mcd, 5ma, 2.9Vf) - Digikey: LNJ937W8CRACT-ND 0805 - 0805 Surface Mount Package 2mA: Red LED (8.8mcd, 2mA, 1.8Vf, Clear) - Low Power [Digikey: 475-2510-1-ND] Green LED (5mcd, 2mA, 1.8Vf, Clear) - Low Power [Digikey: 475-2730-1-ND] Yellow LED (11.3mcd, 2mA, 1.8Vf, Clear) - Low Power [Digikey: 475-2555-1-ND] 20mA: Red LED (104mcd, 20mA, Diffused) - LS R976 [Digikey: 475-1278-6-ND] Red LED (12mcd, 20mA, 2.0Vf, Clear) - APT2012EC [Digikey: 754-1128-1-ND] Green LED (15mcd, 20mA, 2.2Vf, Clear) - APT2012GC [Digikey: 754-1131-1-ND] Orange LED (160mcd, 20mA, 2.1Vf, Clear) - APT2012SECK [Digikey: 754-1130-1-ND] 1206 - 1206 Surface Mount Package Green LED (26mcd, 20mA, Diffused) - LG N971 [Digikey: 475-1407-6-ND] Red LED (15mcd, 20mA, Diffused) - LH N974 [Digikey: 475-1416-6-ND]
M1-M6 = Firgelli SFW5R-1STE1LF:SFW5R-1STE1LF: FFC/FPC CONNECTOR, RECEPTACLE, 5POS 1ROW; MPN: SFW5R-1STE1LF; OC_FARNELL: 1835598; OC_NEWARK: 62K5638; PACKAGE: CONNECTOR-5POS; SUPPLIER: FCI
POWER_IN = con-jack:JACK-PLUG: DC POWER JACK Power Jack, DC, Right Angle, Through Hole, Rated 5A at 16VDC, PC Terminals Distributor: Farnell (www.Farnell.de) Drawing: 84N1161.pdf / 84N1162.pdf Manufacturer: SPC Technology (www.spctechnology.com) Type: SPC4077 / SPC 4078; OC_FARNELL: unknown; OC_NEWARK: unknown
Q2 = adafruit:CRYSTAL: CRYSTAL; OC_FARNELL: 1667008; OC_NEWARK: unknown
R1 R9-R11 R13 R15 R30 R45 R46 = resistor:R-EU_: RESISTOR, European symbol
U2-U4 = DRV8833RTYT:DRV8833RTYT: DUAL H-BRIDGE MOTOR DRIVER,QFN-16; MPN: DRV8833RTYT; OC_FARNELL: 2057087; OC_NEWARK: 64T2942; PACKAGE: QFN-16; SUPPLIER: TEXAS INSTRUMENTS
USB = adafruit:USB: USB Connectors USBMINIB - Surface Mount Female Mini-B USB Connector 4UConnector: 06564 By microbuilder.eu Thru-hole RA Female Mini-B USB Connector 4UConnector: 18732 By ladyada.net

## Net classes
0 default: clearance 0.205 mm

## Board
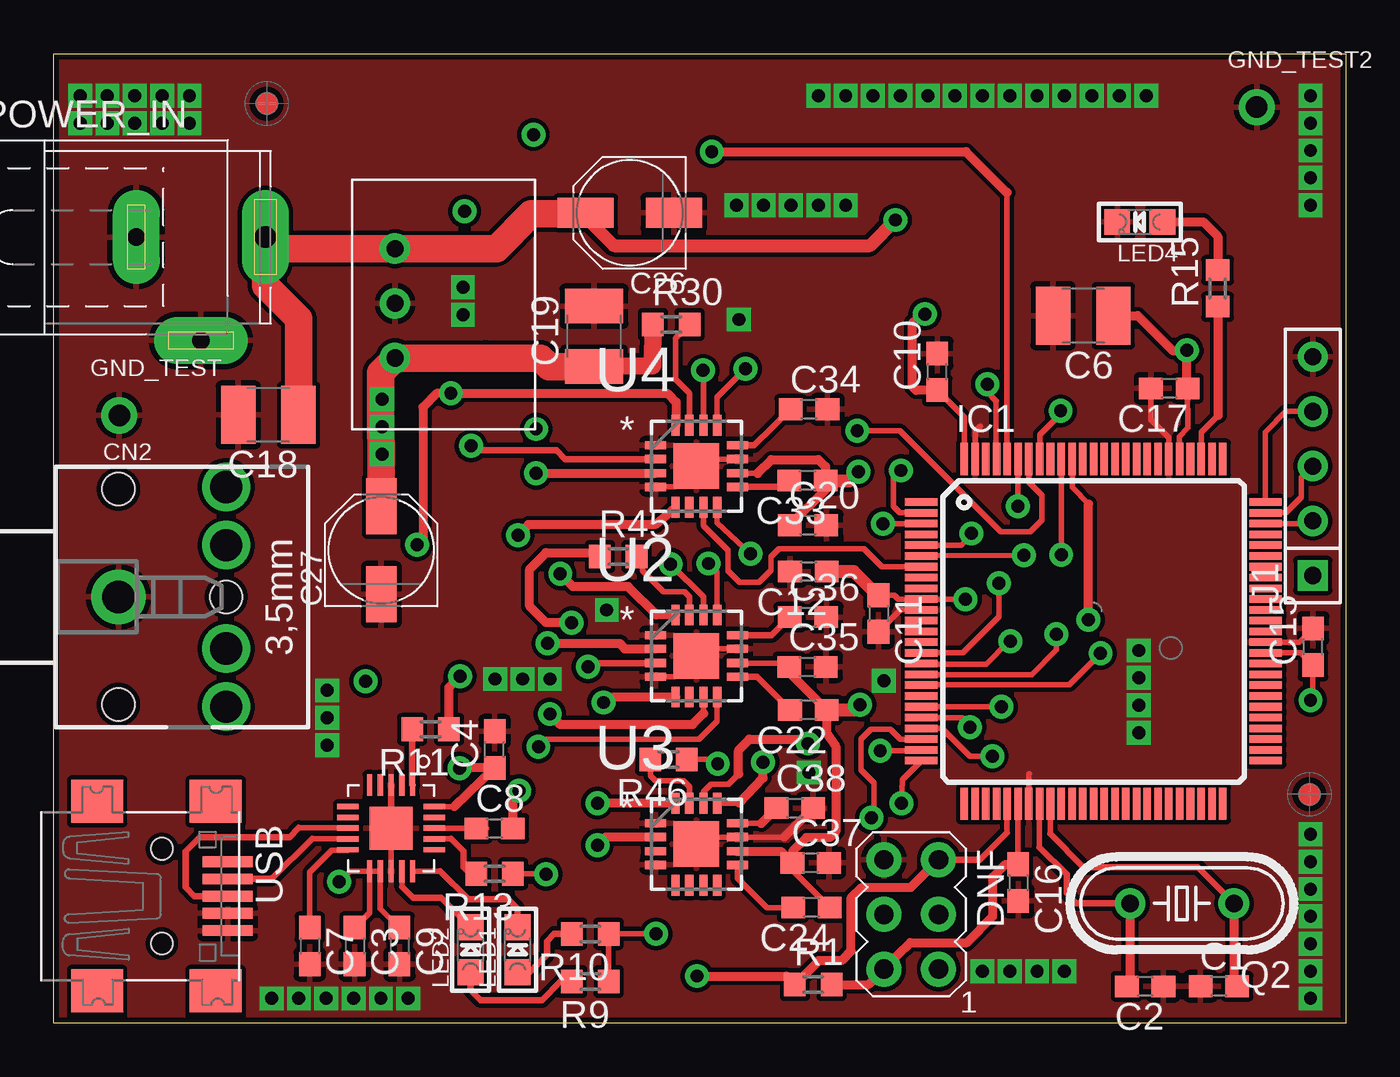
[diagram p7: board, top side]
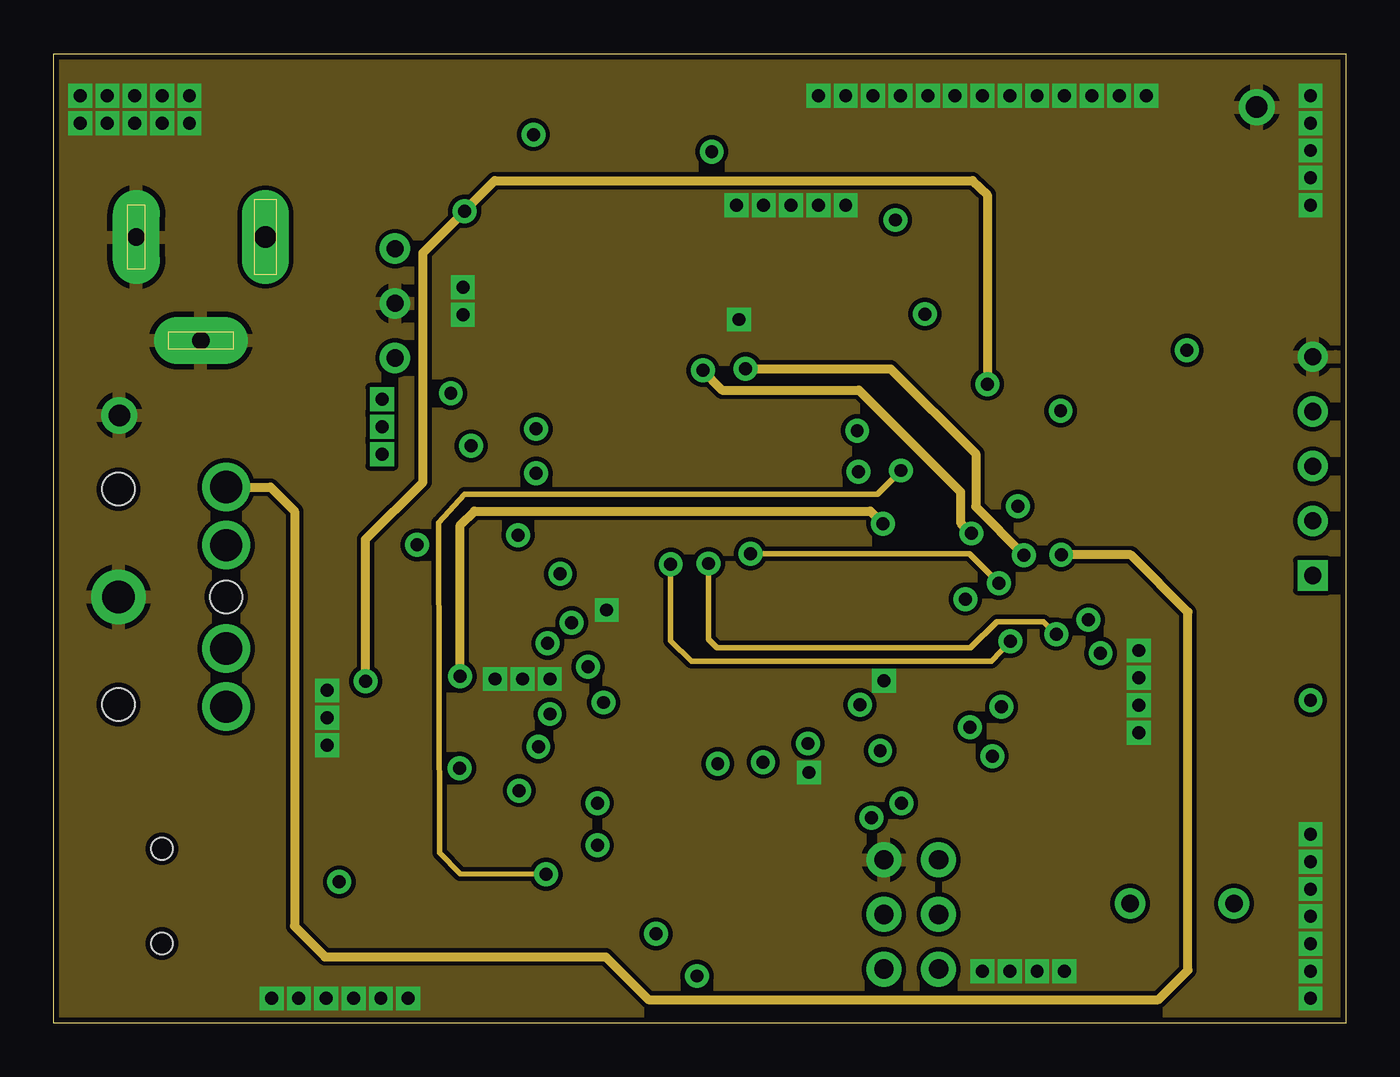
[diagram p8: board, inner layer Route2]
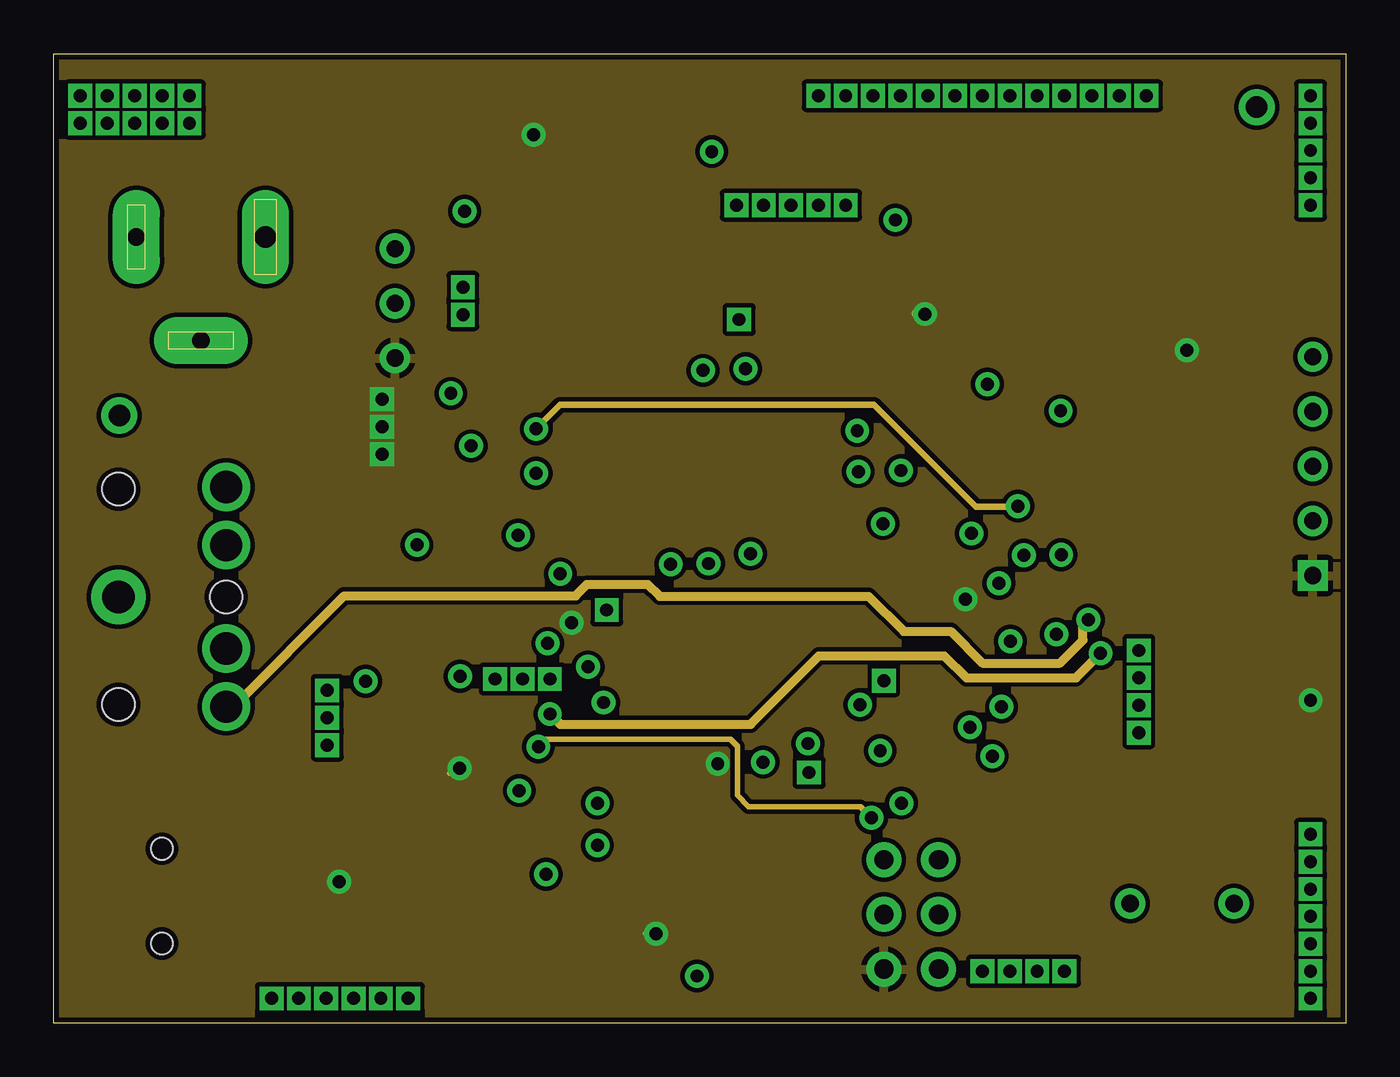
[diagram p9: board, inner layer Route15]
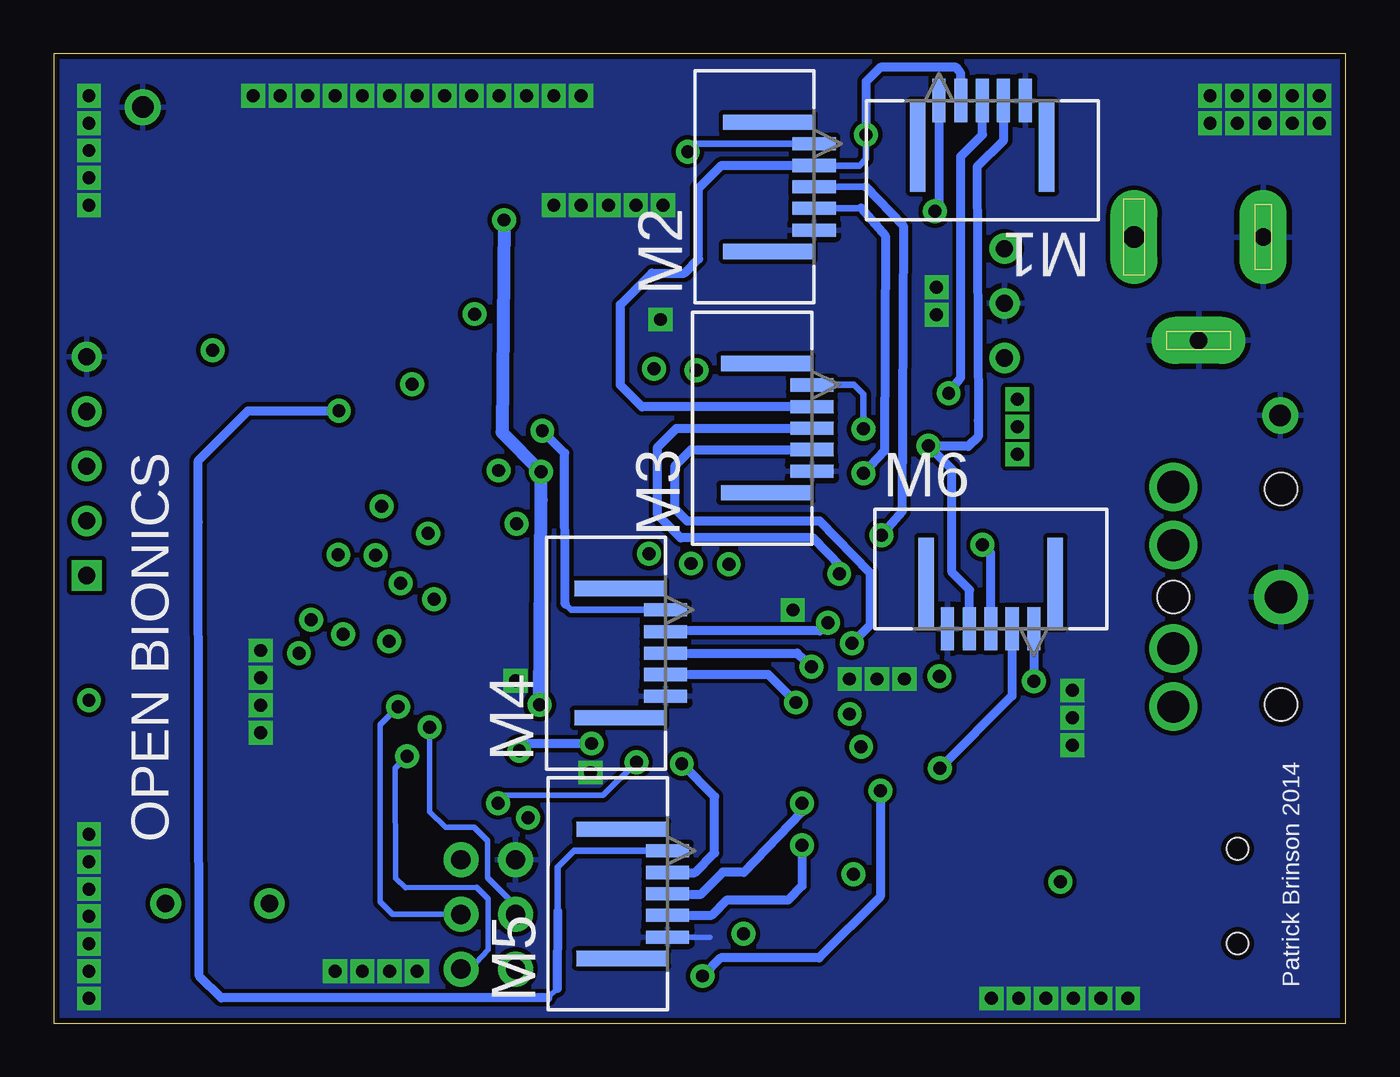
[diagram p10: board, bottom side, seen from below]

Size 60 x 45 mm. Coordinates in mm from the lower left corner, seen from the top.
Outline: 0,0 0,45 60,45 60,0 0,0
Copper layers (1*2*15*16): Top 0.035mm / dielectric 0.2mm / Route2 0.035mm / dielectric 1mm / Route15 0.035mm / dielectric 0.2mm / Bottom 0.035mm
Design rules "SparkFun *": minimum track width 8mil, minimum drill 20mil, track to track 8mil, track to pad 8mil, pad to pad 8mil, via to via 8mil, smd to smd 8mil, copper to edge 10mil, drill to drill 8mil, minimum pad ring 12mil, minimum via ring 10mil, stop-mask expansion 4mil, vias tented up to drill 28mil, thermal gap 10mil

### Footprints (pad centres in the part's own frame; a part is rotated, then mirrored left to right if it is on the bottom)
5V_RECOM_0.5A_REGULATOR = drill 0.8: +VIN 3.21,2; +VOUT 8.29,2; GND 5.75,2
C0603 = smd 1.1 x 1: 1 -0.85,0; 2 0.85,0
C1210 = smd 1.6 x 2.7: 1 -1.4,0; 2 1.4,0
PANASONIC_C = smd 2.6 x 1.4: + 2.05,0; - -2.05,0
STX3100 = drill 1.5 pad 2.54: 1 2.7,-0.1 | drill 1.5: 2 7.7,5; 3 7.7,2.3; 4 7.7,-2.5; 5 7.7,-5.2 | hole 1.5: 2.7,4.9; 2.7,-5.1; 7.7,-0.1
AVRISP = drill 0.9 pad 1.626: 1 -1.27,2.54; 2 1.27,2.54; 3 -1.27,0; 4 1.27,0; 5 -1.27,-2.54; 6 1.27,-2.54
FTDI_FT231XQ-R_PACKAGE = smd 0.25 x 1: 3V3OUT 0.968,-2.032; CBUS2 -0.532,-2.032; CBUS3 0.968,1.968; CTS# -1.032,-2.032; DTR# -0.032,1.968; RTS# -0.532,1.968; TXD 0.468,1.968; USBDM 0.468,-2.032; USBDP -0.032,-2.032; VCCIO -1.032,1.968 | smd 1 x 0.25: CBUS0 1.968,0.968; CBUS1 1.968,0.468; DCD# -2.032,-1.032; DSR# -2.032,-0.532; GND_PIN3 -2.032,-0.032; GND_PIN13 1.968,-0.032; RESET# 1.968,-1.032; RI# -2.032,0.468; RXD -2.032,0.968; VCC 1.968,-0.532 | smd 2 x 2: GND_PIN21 -0.032,-0.032
1X01_ROUND = drill 1 pad 1.676: 1 0,0
TQFP100 = smd 1.5 x 0.35: 1 -8,6; 2 -8,5.5; 3 -8,5; 4 -8,4.5; 5 -8,4; 6 -8,3.5; 7 -8,3; 8 -8,2.5; 9 -8,2; 10 -8,1.5; 11 -8,1; 12 -8,0.5; 13 -8,0; 14 -8,-0.5; 15 -8,-1; 16 -8,-1.5; 17 -8,-2; 18 -8,-2.5; 19 -8,-3; 20 -8,-3.5; 21 -8,-4; 22 -8,-4.5; 23 -8,-5; 24 -8,-5.5; 25 -8,-6; 51 8,-6; 52 8,-5.5; 53 8,-5; 54 8,-4.5; 55 8,-4; 56 8,-3.5; 57 8,-3; 58 8,-2.5; 59 8,-2; 60 8,-1.5; 61 8,-1; 62 8,-0.5; 63 8,0; 64 8,0.5; 65 8,1; 66 8,1.5; 67 8,2; 68 8,2.5; 69 8,3; 70 8,3.5; 71 8,4; 72 8,4.5; 73 8,5; 74 8,5.5; 75 8,6 | smd 0.35 x 1.5: 26 -6,-8; 27 -5.5,-8; 28 -5,-8; 29 -4.5,-8; 30 -4,-8; 31 -3.5,-8; 32 -3,-8; 33 -2.5,-8; 34 -2,-8; 35 -1.5,-8; 36 -1,-8; 37 -0.5,-8; 38 0,-8; 39 0.5,-8; 40 1,-8; 41 1.5,-8; 42 2,-8; 43 2.5,-8; 44 3,-8; 45 3.5,-8; 46 4,-8; 47 4.5,-8; 48 5,-8; 49 5.5,-8; 50 6,-8; 76 6,8; 77 5.5,8; 78 5,8; 79 4.5,8; 80 4,8; 81 3.5,8; 82 3,8; 83 2.5,8; 84 2,8; 85 1.5,8; 86 1,8; 87 0.5,8; 88 0,8; 89 -0.5,8; 90 -1,8; 91 -1.5,8; 92 -2,8; 93 -2.5,8; 94 -3,8; 95 -3.5,8; 96 -4,8; 97 -4.5,8; 98 -5,8; 99 -5.5,8; 100 -6,8
M1X5 = drill 0.8 square: 1 -5.08,0 | drill 0.8: 2 -2.54,0; 3 0,0; 4 2.54,0; 5 5.08,0
CHIPLED_0805 = smd 1.2 x 1.2: A 0,-1.05; C 0,1.05
FCI_SFW5R-1STE1LF = smd 0.61 x 2.007: 1 2.007,2.743; 2 0.991,2.743; 3 0,2.743; 4 -0.991,2.743; 5 -2.007,2.743 | smd 0.711 x 4.191: 6 -2.997,4.877; 7 2.997,4.877
SPC4078 = drill 0.8 pad 2.184 long: 1 -3,0; 2 0,-4.8 | drill 1 pad 2.184 long: 3 3,0
HC49/S = drill 0.813: 1 -2.413,0; 2 2.413,0
R0603 = smd 1 x 1.1: 1 -0.85,0; 2 0.85,0
QFN65P400X400X80-17N = smd 0.965 x 0.381: 1 -1.905,0.965; 2 -1.905,0.33; 3 -1.905,-0.33; 4 -1.905,-0.965; 9 1.905,-0.965; 10 1.905,-0.33; 11 1.905,0.33; 12 1.905,0.965 | smd 0.381 x 0.965: 5 -0.965,-1.905; 6 -0.33,-1.905; 7 0.33,-1.905; 8 0.965,-1.905; 13 0.965,1.905; 14 0.33,1.905; 15 -0.33,1.905; 16 -0.965,1.905 | smd 2.108 x 2.108: 17 0,0
USB-MINIB = smd 0.5 x 2.308: D+ 0,4.064; D- -0.8,4.064; GND 1.6,4.064; ID 0.8,4.064; VBUS -1.6,4.064 | smd 2 x 2.4: GND1 -4.4,-2; GND2 -4.4,3.5; GND3 4.4,3.5; GND4 4.4,-2 | hole 1: -2.2,1; 2.2,1

### Placement (x,y rotation side)
5V_REG  13.85,39.17 270 top
C1  54.11,1.71 0 top
C2  50.68,1.71 180 top
C3  13.97,3.58 270 top
C4  20.47,12.7 90 top
C6  47.81,32.84 180 top
C7  11.89,3.58 270 top
C8  20.47,9.04 0 top
C9  16.05,3.58 270 top
C10  41.03,30.24 90 top
C11  38.3,19.01 270 top
C12  35.04,20.96 180 top
C15  58.48,17.48 90 top
C16  44.8,6.52 270 top
C17  51.8,29.47 180 top
C18  9.96,28.24 180 top
C19  25.09,31.89 90 top
C20  35.03,23.11 0 top
C22  35.04,14.55 180 top
C24  35.19,5.37 180 top
C26  26.75,37.62 180 top
C27  15.21,21.95 90 top
C33  35,25.2 180 top
C34  35.08,28.5 0 top
C35  35,16.54 0 top
C36  35.03,18.85 0 top
C37  35.15,7.44 0 top
C38  34.42,9.98 0 top
CN2  0.3,19.89 0 top
DNF  39.82,5.04 180 top
FTDI-FT231-XQ-R  15.7,9.02 270 top
GND_TEST  3.04,28.21 0 top
GND_TEST2  55.87,42.52 0 top
IC1  48.29,18.19 0 top
J1  58.47,25.86 90 top
LED1  21.54,3.4 0 top
LED2  19.35,3.4 0 top
LED4  50.43,37.19 90 top
M1  16.88,45.58 180 bottom
M2  21.94,38.82 90 bottom
M3  22.05,27.62 90 bottom
M4  28.84,17.18 90 bottom
M5  28.76,6 90 bottom
M6  16.48,15.57 0 bottom
POWER_IN  6.83,36.49 0 top
Q2  52.39,5.55 180 top
R1  35.27,1.78 0 top
R9  24.92,1.93 180 top
R10  24.92,4.14 180 top
R11  17.5,13.64 180 top
R13  20.47,6.93 180 top
R15  54.05,34.11 90 top
R30  28.68,32.44 0 top
R45  26.21,21.67 0 top
R46  28.55,12.24 180 top
U2  29.84,17.04 0 top
U3  29.84,8.31 0 top
U4  29.84,25.86 0 top
U$1  [FIDUCIAL_G10]  58.32,10.62 270 top
U$2  [FIDUCIAL_G10]  9.89,42.69 270 top
USB  4.01,5.89 270 top

### Tracks (layer width: path | path; a pad name or v marks a point on that pad's centre or on a via)
+12V  (via drill 0.6)
  Top 0.254: U4.10 32.69,25.53 | 35.84,25.21 C33.1 35.85,24.79 | C37.1 34.3,7.1 C24.1 | U2.10 34.1,16.71 C35.1
  Top 0.305: C35.1 34.18,16.26
  Top 0.406: 32.69,25.53 33.33,26.16 35.51,26.16 35.84,25.83 35.84,25.21 | 35.85,24.79 C20.1 | 34.18,16.26 C22.1 35.89,13.49 36.32,12.85 36.32,8.89 36.04,8.61 34.95,8.61 34.31,7.98 34.31,7.45 C37.1 33.77,7.98 U3.10
  Top 0.61: C26.+ 24.7,37.41 26.01,36.09 37.9,36.09 v39.09,37.29 | C33.1 35.88,25.17 36.93,25.17 v37.36,25.6 | C22.1 37.2,14.55 v37.44,14.78 | 34.37,7.5 C37.1
  Top 1.27: C18.1 11.38,28.25 11.38,32.69 9.83,34.24 POWER_IN.3 10.37,35.96 5V_REG.+VIN 20.56,35.96 22.17,37.57 24.64,37.57 C26.+
  Bottom 0.61: v39.09,37.29 39.19,27.43 v37.36,25.6 37.36,24.28 v37.44,14.78
GND  (via drill 0.6)
  Top 0.254: IC1.62 57.84,17.69 C15.2 | FTDI-FT231-XQ-R.GND_PIN13 15.66,8.96 | IC1.32 45.28,11.55 45.31,11.58 | IC1.99 42.8,27.48 43.03,27.71 | IC1.11 39.32,19.19 C11.2 | U3.17 30.18,8.64 U3.11 33.92,8.64 | U2.17 30.18,17.37 U2.11 | U4.11 30.18,26.19 U4.17 28.88,24.89 U4.4 | 35.87,18.84 C36.2 | U2.4 28.83,16.08 29.64,16.89 | IC1.81 51.78,27.18 50.95,28.02 C17.2
  Top 0.305: FTDI-FT231-XQ-R.GND_PIN3 FTDI-FT231-XQ-R.GND_PIN21 | 15.66,8.96 15.7,8.99
  Top 0.406: 33.92,8.64 C38.2
  Bottom 0.254: M5.5 30.36,3.99 29.52,3.99
  other vias: 38.56,15.9 10.11,1.14 11.38,1.14 12.65,1.14 13.92,1.14 15.19,1.14 16.46,1.14 44.4,2.41 43.13,2.41 45.67,2.41 46.94,2.41 58.37,1.14 58.37,3.68 58.37,2.41 58.37,4.95 58.37,6.22 58.37,7.49 58.37,8.76 35.08,11.63 58.37,37.97 58.37,39.24 58.37,40.51 58.37,41.78 58.37,43.05 1.22,43.05 2.49,43.05 3.76,43.05 5.03,43.05 6.3,43.05 6.3,41.78 5.03,41.78 3.76,41.78 2.49,41.78 1.22,41.78 31.83,32.66 50.39,13.49 50.39,14.76 50.39,16.03 50.39,17.3 35.51,43.05 36.78,43.05 38.05,43.05 39.32,43.05 40.59,43.05 41.86,43.05 43.13,43.05 44.4,43.05 45.67,43.05 46.94,43.05 48.21,43.05 49.48,43.05 50.75,43.05 19,34.16 19,32.89 31.7,37.97 32.97,37.97 34.24,37.97 35.51,37.97 36.78,37.97 25.68,19.18 12.7,12.9 12.7,14.17 12.7,15.44 23.04,15.98 21.77,15.98 20.5,15.98
  pour Top: 0,0 0,45 60,45 60,0
  pour Bottom: 0,0 0,45 60,45 60,0
  pour Route2: 0,0 0,45 60,45 60,0
MEGA_MISO  (via drill 0.6)
  Top 0.254: IC1.22 41.25,13.69 42.55,12.39 v43.59,12.39
  Bottom 0.254: DNF.1 40.67,2.5 39.83,3.4 39.83,5.77 40.36,6.3 43.66,6.27 44.12,6.73 44.15,11.84 v43.59,12.39
MEGA_MOSI  (via drill 0.6)
  Top 0.254: v42.55,13.74 42.37,13.99 42.19,14.17 40.3,14.17 IC1.21
  Bottom 0.254: DNF.4 38.55,5.46 39.85,6.76 39.85,8.46 40.49,9.09 41.81,9.09 42.55,9.8 v42.55,13.74
MEGA_RST  (via drill 0.6)
  Top 0.254: 44.27,8.84 44.27,10.17 IC1.30
  Top 0.305: DNF.5 43.02,7.58 44.27,8.84
  Top 0.406: DNF.5 39.81,6.3 37.54,6.3 37.03,5.82 37.03,3.35 36.58,2.9 35.53,2.9 R1.1 34.02,2.18 v29.87,2.18 | C8.2 21.32,10.45 v21.61,10.79
  Bottom 0.406: v21.61,10.79 21.61,5.87 24.46,3.02 29.03,3.02 v29.87,2.18
MEGA_RXD  (via drill 0.6)
  Top 0.254: R13.1 22.23,6.93 v22.86,6.91 | 39.34,25.63 v39.34,25.65 38.99,25.3 38.99,24 39.31,23.69 IC1.2
  Route2 0.254: v22.86,6.91 18.87,6.93 17.91,7.9 17.88,23.24 19.07,24.56 38.25,24.56 v39.34,25.65
MEGA_SCK  (via drill 0.6)
  Top 0.254: v44.02,14.68 IC1.20
  Bottom 0.254: DNF.3 44.26,5.04 44.86,5.64 44.86,13.84 v44.02,14.68
MEGA_TXD  (via drill 0.6)
  Top 0.254: v38.51,23.19 IC1.3
  Top 0.406: R11.1 18.35,15.58 v18.87,16.1
  Route2 0.406: v18.87,16.1 18.87,23.11 19.53,23.77 37.92,23.77 v38.51,23.19
MOTOR1_CLOSE  (via drill 0.6)
  Top 0.254: U4.13 30.81,29.06 v32.13,30.38 | v45.06,21.72 IC1.6
  Route2 0.406: v32.13,30.38 38.86,30.38 42.82,26.44 42.82,23.98 v45.06,21.72
MOTOR1_OPEN  (via drill 0.6)
  Top 0.254: U4.14 30.18,30.28 v30.15,30.3 | v42.62,22.73 42.62,22.63 42.16,22.17 40.3,22.17 IC1.5
  Route2 0.406: v30.15,30.3 30.12,30.3 31.04,29.39 37.39,29.39 42.11,24.66 42.11,23.24 v42.62,22.73
MOTOR1_SENSE  (via drill 0.6)
  Top 0.254: IC1.97 43.76,26.21 43.76,28.91
  Top 0.305: 43.36,29.31 43.76,28.91
  Top 0.406: v43.36,29.67 43.36,29.31
  Route2 0.406: v43.36,29.67 43.36,38.46 42.67,39.12 20.47,39.12 19.05,37.69 v19.07,37.69 17.14,35.76 17.14,25.12 14.48,22.45 v14.48,15.88
  Bottom 0.406: M1.1 18.89,37.88 v19.07,37.69 | M6.1 v14.48,15.88
MOTOR2_CLOSE  (via drill 0.6)
  Top 0.254: U4.8 30.81,23.24 v32.36,21.79 | v43.89,20.42 43.89,18.87 42.22,17.2 IC1.15
  Route2 0.254: v32.36,21.79 42.52,21.79 v43.89,20.42
MOTOR2_OPEN
  Top 0.254: IC1.7 38.46,21.18 37.62,22.02 33.68,22.02 33.3,21.64 33.3,21.03 32.74,20.47 31.85,20.47 31.32,21.01 31.32,21.95 30.18,23.09 U4.7
MOTOR2_SENSE  (via drill 0.6)
  Top 0.254: 44.3,26.17 IC1.96 | 44.27,26.17 IC1.96 | 44.27,38.56 44.27,26.2 IC1.96
  Top 0.406: v30.56,40.46 42.37,40.46 44.27,38.56
  Bottom 0.305: M2.1 30.19,40.83 v30.56,40.46
MOTOR3_CLOSE  (via drill 0.6)
  Top 0.254: U2.13 30.81,20.93 v30.4,21.34 | v46.56,18.06 46.56,17.32 45.41,16.18 IC1.17
  Route2 0.254: v30.4,21.34 30.4,17.83 30.81,17.42 42.57,17.42 43.79,18.64 45.95,18.64 v46.56,18.06
MOTOR3_OPEN  (via drill 0.6)
  Top 0.254: U2.14 30.18,19.79 v28.65,21.31 | v44.42,17.73 44.32,17.68 43.31,16.66 40.31,16.66 IC1.16
  Route2 0.254: v28.65,21.31 28.65,17.75 29.62,16.79 43.54,16.79 v44.42,17.73
MOTOR3_SENSE  (via drill 0.6)
  Top 0.254: v44.78,24 IC1.95
  Route15 0.254: 44.76,23.98 44.78,23.98 v44.78,24
  Route15 0.305: 44.76,23.98 42.82,23.98 38.1,28.7 23.52,28.7 v22.4,27.58
  Bottom 0.305: M3.1 22.84,29.63 22.4,29.18 v22.4,27.58
MOTOR4_CLOSE  (via drill 0.6)
  Top 0.254: U2.8 30.81,14.02 29.97,13.18 22.89,13.18 v22.5,12.83 | 40.56,13.18 IC1.23 | IC1.23 | IC1.23 39.32,13.18 38.86,13.64 37.95,13.64 37.49,13.18 37.49,11.76 38.1,11.15 38.1,9.65 v37.97,9.53
  Route15 0.254: v22.5,12.83 22.86,13.18 31.42,13.18 31.75,12.85 31.75,10.57 32.26,10.03 37.47,10.03 v37.97,9.53
MOTOR4_OPEN  (via drill 0.6)
  Top 0.254: v48.62,17.17 48.62,17.14 47.17,15.7 IC1.18 | 30.18,14.38 U2.7
  Top 0.406: v23.04,14.35 23.52,13.87 29.67,13.87 30.18,14.38
  Route15 0.406: v23.04,14.35 23.52,13.87 32.36,13.87 35.53,17.04 41.35,17.04 42.39,16.03 47.47,16.03 v48.62,17.17
MOTOR4_SENSE  (via drill 0.6)
  Top 0.254: v37.31,27.51 39.29,27.51 43.99,22.81 45.36,22.81 45.9,23.34 45.9,24.51 45.29,25.12 45.29,26.08 IC1.94
  Bottom 0.305: M4.1 35.97,19.18 36.25,19.46
  Bottom 0.406: 36.25,19.46 36.27,26.47 v37.31,27.51
MOTOR5_CLOSE  (via drill 0.6)
  Top 0.254: U3.13 31.83,10.21 | v39.37,10.21 39.4,11.3 IC1.25
  Top 0.406: 31.83,10.21 32.94,11.38 v32.94,12.12
  Bottom 0.254: v32.94,12.12 34.49,10.57 39.01,10.57 v39.37,10.21
MOTOR5_OPEN  (via drill 0.6)
  Top 0.254: U3.14 30.18,10.74 30.53,11.1 31.34,11.1 31.8,11.56 | v38.38,12.65 40.25,12.65 IC1.24
  Top 0.406: 31.8,11.56 31.8,12.68 32.31,13.18 34.8,13.18 v35.03,12.98
  Bottom 0.406: v35.03,12.98 38.05,12.98 v38.38,12.65
MOTOR5_SENSE  (via drill 0.6)
  Top 0.254: v46.76,28.42 46.76,28.3 45.8,27.3 IC1.93
  Bottom 0.254: 36.63,1.6 37.06,1.17
  Bottom 0.305: 36.6,5.18 36.6,7.24 35.84,8 M5.1
  Bottom 0.406: 36.6,5.18 36.63,1.6 | 37.06,1.17 52.22,1.17 53.24,2.18 53.29,23.27 53.29,26.11 50.98,28.42 v46.76,28.42
MOTOR6_CLOSE
  Top 0.254: 47.78,10.19 IC1.37
MUSCLE_SENSE1  (via drill 0.6)
  Top 0.254: IC1.91 v46.79,21.74
  Route2 0.406: CN2.2 10.06,24.89 11.18,23.77 11.18,4.5 12.6,3.07 25.63,3.07 27.61,1.09 51.31,1.09 52.68,2.46 52.68,19.07 50.01,21.74 v46.79,21.74
MUSCLE_SENSE2  (via drill 0.6)
  Top 0.254: 48.06,24.11 47.3,24.87 47.3,26.18 IC1.90
  Top 0.406: v48.06,18.72 48.06,24.11
  Route15 0.406: CN2.5 8.36,14.69 13.49,19.84 24.23,19.84 24.77,20.37 27.58,20.37 28.14,19.81 37.85,19.81 39.47,18.19 41.66,18.19 43.13,16.71 46.74,16.71 47.8,17.78 47.8,18.47 v48.06,18.72
N$2
  Top 0.254: IC1.78 53.28,27.43 54.08,28.22 | 54.08,32.98 R15.1
  Top 0.406: 54.08,28.22 54.08,32.98
N$8
  Top 0.305: U4.9 33.85,24.89 C33.2
N$11
  Top 0.406: LED4.A 53.38,37.19 54.05,36.52 R15.2
N$13
  Top 0.254: 11.38,9.07 13.65,9.07 FTDI-FT231-XQ-R.USBDP
  Top 0.305: USB.D+ 6.53,5.89 6.12,6.3 6.12,7.98 6.78,8.64 10.95,8.64 11.38,9.07
N$14
  Top 0.254: 11.99,8.56 13.65,8.56 FTDI-FT231-XQ-R.USBDM
  Top 0.305: USB.D- 10.12,6.69 11.99,8.56
N$15
  Top 0.254: C7.1 11.89,7.01 12.9,8.03 13.64,8.03 FTDI-FT231-XQ-R.3V3OUT
N$16
  Top 0.254: FTDI-FT231-XQ-R.DTR# 20.09,9.05
  Top 0.305: 20.09,9.05 C8.1
N$18
  Top 0.254: FTDI-FT231-XQ-R.TXD 18.45,8.55
  Top 0.305: 18.45,8.55 19.02,7.98 19.02,7.24 19.3,6.96 R13.2
N$19
  Top 0.305: R11.2 16.65,11.06 FTDI-FT231-XQ-R.RXD
N$20
  Top 0.254: FTDI-FT231-XQ-R.CBUS0 17.95,7.05
  Top 0.305: 17.95,7.05 19.25,5.74 21.11,5.74 21.54,5.31 LED1.C
N$21
  Top 0.254: FTDI-FT231-XQ-R.CBUS1 16.16,6.34
  Top 0.305: 16.16,6.34 16.69,5.82 17.99,5.82 LED2.C
N$22
  Top 0.305: R9.2 23.55,1.93 22.68,1.07 19.81,1.07 19.36,1.52 LED2.A
N$23  (via drill 0.6)
  Top 0.406: U2.16 27.99,18.95 26.67,20.27 24.11,20.27 v23.52,20.85
  Bottom 0.406: v23.52,20.85 23.47,20.85 23.44,21.18 24.74,22.53 30.89,22.53 31.95,23.6 31.95,26.75 31.09,27.61 M3.3
N$24
  Top 0.305: LED1.A 22.09,2.35 22.91,3.17 22.91,3.81 23.24,4.14 R10.2
N$27  (via drill 0.6)
  Top 0.406: U3.2 25.63,8.64 v25.25,8.26
  Bottom 0.406: v25.25,8.26 25.25,6.38 25.88,5.71 28.73,5.71 29.43,5.01 M5.4
N$28  (via drill 0.6)
  Top 0.406: U3.16 v25.25,10.21
  Bottom 0.305: 27.96,6.99 27.99,7.01 | 31.47,5.97 M5.3
  Bottom 0.406: v25.25,10.21 25.25,9.8 27.96,6.99 | 27.99,7.01 28.93,7.01 29.97,5.97 31.47,5.97
N$29
  Top 0.254: J1.4 57.23,28.4 56.26,27.43 56.26,24.21 IC1.75
N$30  (via drill 0.6)
  Top 0.406: v22.94,17.63 26.29,17.63 26.52,17.37 U2.2
  Bottom 0.406: v22.94,17.63 22.1,18.47 22.1,20.9 24.43,23.32 30.58,23.32 31.14,23.88 31.14,25.88 30.4,26.62 24.8,26.62 M3.4
N$31  (via drill 0.6)
  Top 0.406: U2.5 25.98,15.14 v25.53,14.88
  Bottom 0.406: M4.4 26.83,16.18 v25.53,14.88
N$32  (via drill 0.6)
  Top 0.305: U2.3 24.99,16.71 v24.82,16.54
  Bottom 0.406: M4.3 25.48,17.18 v24.82,16.54
N$33  (via drill 0.6)
  Top 0.254: 28.91,27.79 U4.16
  Top 0.406: 28.91,27.79 28.91,28.83 28.5,29.23 v18.44,29.23 17.78,29.23 17.14,28.6 17.14,22.43 v16.87,22.2
  Bottom 0.305: 16.87,42.82 M1.3
  Bottom 0.406: v18.44,29.23 17.87,29.98 17.87,40.24 16.87,41.25 16.87,42.82 | M6.3 16.48,21.82 v16.87,22.2
N$34  (via drill 0.6)
  Top 0.305: U4.2 23.75,26.19 23.34,26.59 19.58,26.59 v19.38,26.8
  Bottom 0.305: 15.88,42.82 M1.4
  Bottom 0.406: 15.88,42.82 15.88,41 17.12,39.75 17.07,27.96 17.07,27.23 17.53,26.77 19.36,26.77 v19.38,26.8 18.29,25.7 18.29,20.93 17.48,20.12 M6.4
N$35  (via drill 0.6)
  Top 0.254: 28.85,23.93 U4.5
  Top 0.406: 28.85,23.93 27.94,23.14 22.05,23.14 v21.57,22.66
  Bottom 0.305: 22.29,38.82 M2.3
  Bottom 0.406: 22.29,38.82 20.55,37.01 20.6,23.75 v21.57,22.66
N$36  (via drill 0.6)
  Top 0.254: 27.91,25.53 U4.3
  Top 0.406: v22.4,25.53 27.91,25.53
  Bottom 0.305: 22.49,37.83 M2.4
  Bottom 0.406: 22.49,37.83 21.39,36.55 21.41,26.57 v22.4,25.53
N$38
  Top 0.254: 29.53,27.77 29.53,29.25 28.88,29.9 28.88,31.79 R30.2
  Top 0.305: 29.53,27.77 U4.15
N$42
  Top 0.305: U4.12 32.53,26.82 C34.1
N$43
  Top 0.305: U2.9 32.66,16.08 C22.2
N$44
  Top 0.305: U2.12 33.34,18.01 C36.1
N$45
  Top 0.254: 29.53,18.96 U2.15 29.52,19.79 29.29,20.02 28.32,20.02 27.33,21.01 27.33,21.4 R45.2
N$47
  Top 0.254: U3.12 32.86,9.27
  Top 0.406: 32.86,9.27 C38.1
N$48
  Top 0.254: IC1.74 57.21,23.69 57.94,24.41 57.94,25.35 J1.3
N$49
  Top 0.254: U3.9 31.75,6.73 33.12,5.36 34.33,5.36 C24.2
N$50
  Top 0.254: IC1.73 58.34,23.19 J1.2
N$51
  Top 0.254: 29.53,10.22 U3.15 29.52,10.97 29.23,11.25 27.94,11.25 27.71,11.48 R46.2
VCC  (via drill 0.6)
  Top 0.254: C3.1 14.66,5.13 FTDI-FT231-XQ-R.RESET# FTDI-FT231-XQ-R.VCC | FTDI-FT231-XQ-R.VCC 15.16,5.32 C9.1 | IC1.100 42.29,28.13 C10.1 | IC1.80 52.27,26.2 52.27,27.23 52.67,27.63 C17.1 52.68,28.94 | IC1.31 44.78,7.36 C16.1 | 56.27,17.17 IC1.61 57.92,17.19 C15.1 58.48,15.05 v58.37,14.99 | C11.1 39.04,19.86 39.22,19.68 39.22,19.69 IC1.10 | IC1.10 | R9.1 R10.1 v27.96,4.14 | FTDI-FT231-XQ-R.VCCIO 18.6,10.05 | FTDI-FT231-XQ-R.VCC 13.76,7.05 v13.26,6.55 | 22.63,30.86 22.91,30.58 | DNF.2 38.55,2.54 | C12.1 | IC1.10 v42.34,19.69 v42.34,19.68 | R46.1 30.63,12.24 v30.84,12.04 | 25.03,22 R45.1
  Top 0.406: 18.6,10.05 C4.1 19,11.86 v18.85,11.84 | 38.55,2.54 39.78,3.73 42.42,3.73 43.61,4.95 43.61,6.78 44.2,7.37 C16.1 | R1.2 37.83,1.78 DNF.2 | v40.46,32.92 39.88,32.51 39.88,29.54 40.04,29.38 41.02,29.38 C10.1 | C17.1 52.63,29.47 v52.63,31.24 53.01,31.22 51.97,31.22 50.34,32.84 C6.1 | v24.05,18.59 22.86,18.59 22.1,19.36 22.1,21.08 22.86,21.84 25.18,21.84 R45.1
  Top 0.61: 20.17,30.75 20.04,30.88 | C11.1 38.25,19.86 37.16,20.95 C12.1 | v52.63,31.24
  Top 0.813: C19.1 27.81,30.51 R30.1
  Top 1.27: C19.1 23.01,30.48 22.91,30.58 22.62,30.88 20.04,30.88 5V_REG.+VOUT 15.17,30.2 C27.+
  Route15 0.254: v18.85,11.84 18.39,11.61 | v13.26,6.55 13.26,6.53 | v27.96,4.14 27.48,4.14 | v58.37,14.99 58.5,14.99 58.52,14.96 | v52.63,31.24 52.63,31.04 | v42.34,19.68 42.37,19.68 42.39,19.66 | v24.05,18.59 23.77,18.64 23.75,18.62
  Route15 0.406: v40.46,32.92 40.06,32.94 40.08,32.97
  Bottom 0.305: M2.2 22.59,39.81 22.28,40.13 v22.28,41.25
  Bottom 0.406: M5.2 30.22,6.99 29.31,7.9 29.31,10.52 v30.84,12.04 | M4.2 31.54,18.21 24.43,18.21 v24.05,18.59 | M3.2 32.67,28.61 33.68,29.62 33.68,33.36 32.22,34.82 30.71,34.82 30.05,35.48 30.05,38.76 28.98,39.83 24.7,39.83 M2.2 | M1.2 17.87,44.08 18.09,44.37 21.61,44.37 22.28,43.71 v22.28,41.25 | M6.2 15.49,15.19 v18.85,11.84
  other vias: 15.24,28.96 15.24,27.69 15.24,26.42
  pour Route15: 0,0 0,45 60,45 60,0
XTAL1
  Top 0.254: 54.81,1.86 C1.2 | IC1.34 46.28,8.78
  Top 0.305: 46.28,8.78 47.83,7.24 53.12,7.24 Q2.1
  Top 0.406: Q2.1 54.81,1.86
XTAL2
  Top 0.254: 49.98,1.85 C2.2 | IC1.33 45.78,8.16 | 49.97,5.56 Q2.2
  Top 0.305: 45.78,8.16 47.04,6.91 47.04,6.02 47.5,5.56 49.97,5.56
  Top 0.406: Q2.2 49.98,1.85

### Text on the board
bNames: OPEN BIONICS | Patrick Brinson 2014